# EAGLE design main (EAGLE 8.4.0)
CNAME: RJ Cunningham

## Sheet 1 of 10: Power Regulation A sheet for all the voltage regulators in use.
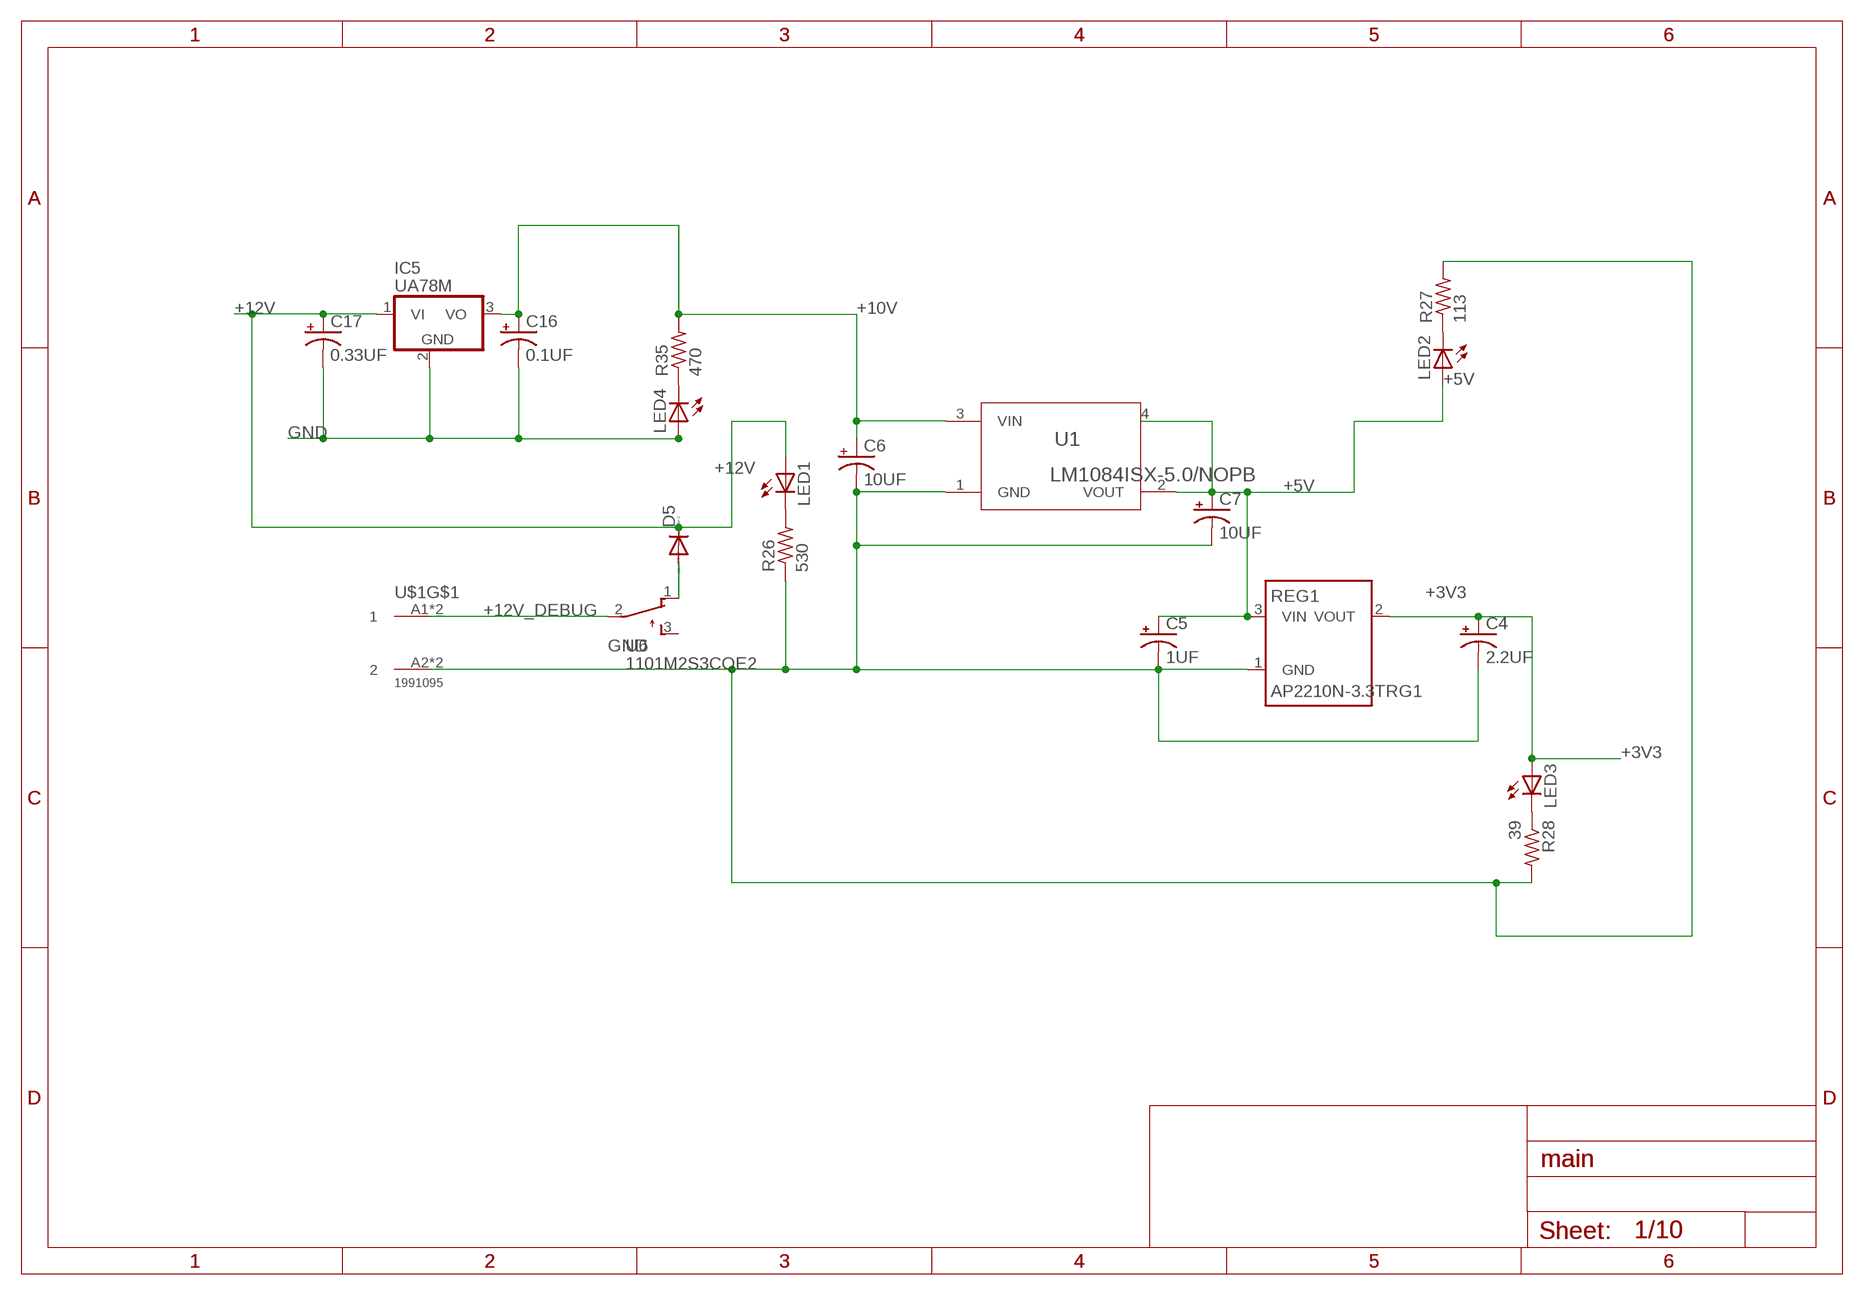
[diagram p0: schematic, sheet 1]

### Parts
C4  2.2UF  CPOL-USE2.5-5  [E2,5-5]
C5  1UF  CPOL-USE2.5-5  [E2,5-5]
C6  10UF  CPOL-USE2.5-5  [E2,5-5]
C7  10UF  CPOL-USE2.5-5  [E2,5-5]
C16  0.1UF  CPOL-USE2.5-5  [E2,5-5]
C17  0.33UF  CPOL-USE2.5-5  [E2,5-5]
D5  DIODE-DO201-15  [DO201-15]
IC5  UA78M  [TO220S]
LED1  LED5MM  [LED5MM]
LED2  LED5MM  [LED5MM]
LED3  LED5MM  [LED5MM]
LED4  LED5MM  [LED5MM]
R26  530  R-US_R0603  [R0603]
R27  113  R-US_R0603  [R0603]
R28  39  R-US_R0603  [R0603]
R35  470  R-US_R0603  [R0603]
REG1  AP2210N-3.3TRG1  [SOT23]
U1  LM1084ISX-5.0/NOPB  [TS3B]
U6  1101M2S3CQE2  [1101M2S3CQE2]
U$1  1991095  [1991095]

### Nets
+3V3: C4.+ LED3.A REG1.2(VOUT) ; also sheet 2,3,4
+5V: C5.+ C7.+ LED2.A REG1.3(VIN) U1.2(VOUT) U1.4 ; also sheet 8
+10V: C6.+ C16.+ IC5.3(VO) R35.2 U1.3(VIN) ; also sheet 3,8
+12V: C17.+ D5.C IC5.1(VI) LED1.A ; also sheet 5,6,8
+12V_DEBUG: U6.2(P) U$1.A1 U$1.B1
GND: C4.- C5.- C6.- C7.- C16.- C17.- IC5.2(GND) LED4.A R26.1 R27.2 R28.2 REG1.1(GND) U1.1(GND) U$1.A2 U$1.B2 ; also sheet 2,3,4,5,6,7,8
N$1: LED1.K(C) R26.2
N$2: LED2.K(C) R27.1
N$3: LED3.K(C) R28.1
N$4: D5.A U6.1(O)
N$9: LED4.K(C) R35.1
Unconnected: U6.3(S)

## Sheet 2 of 10: Load Cell Amplification A schematic for amplifying signals from the load cells. Additional Level-Shifting circuits may be necessary, this is important as well.
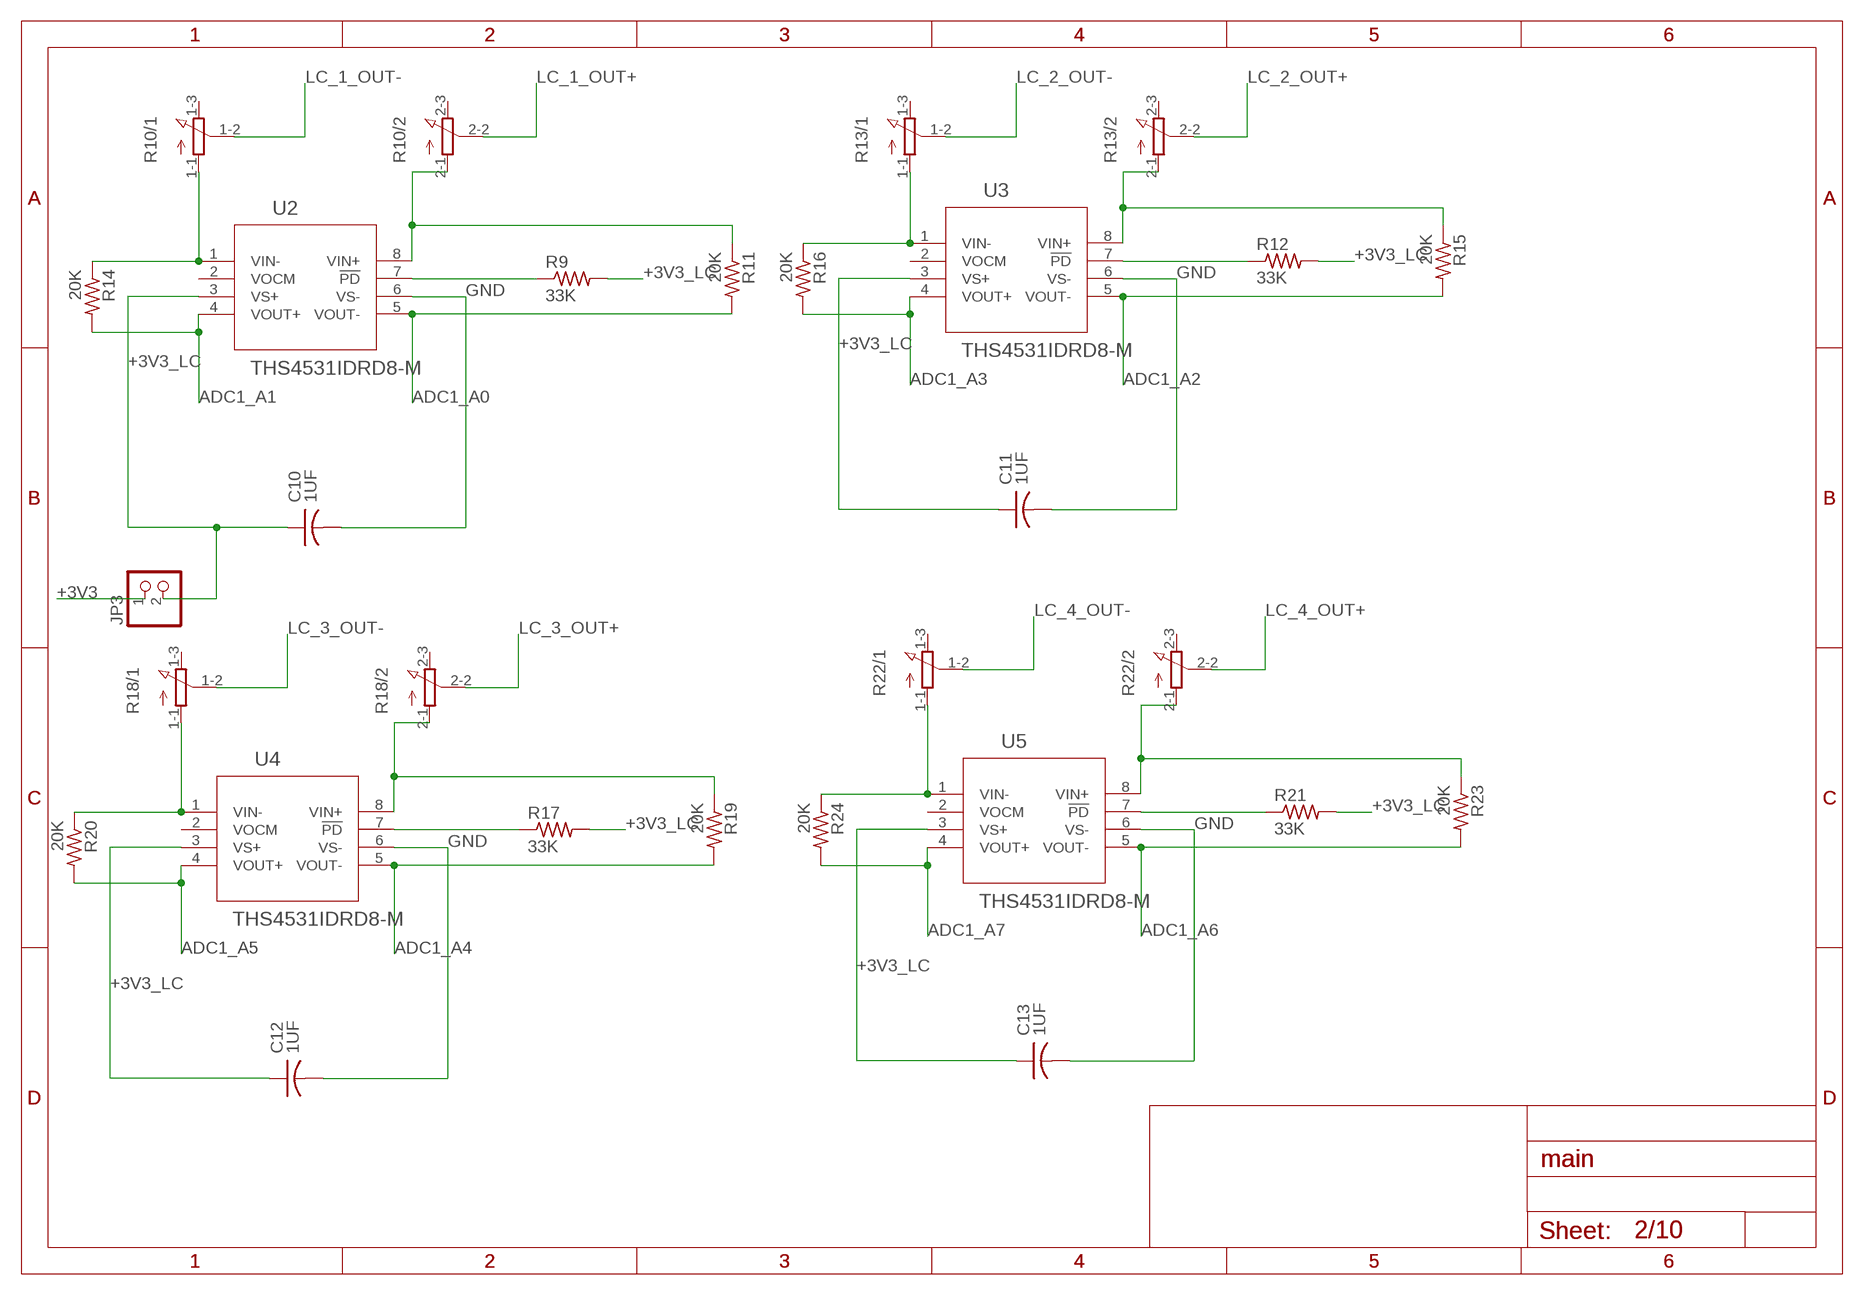
[diagram p1: schematic, sheet 2]

### Parts
C10  1UF  C-USC0603  [C0603]
C11  1UF  C-USC0603  [C0603]
C12  1UF  C-USC0603  [C0603]
C13  1UF  C-USC0603  [C0603]
JP3  PINHD-1X2  [1X02]
R9  33K  R-US_R0603  [R0603]
R10  PTD902  [PTD902]
R11  20K  R-US_R0603  [R0603]
R12  33K  R-US_R0603  [R0603]
R13  PTD902  [PTD902]
R14  20K  R-US_R0603  [R0603]
R15  20K  R-US_R0603  [R0603]
R16  20K  R-US_R0603  [R0603]
R17  33K  R-US_R0603  [R0603]
R18  PTD902  [PTD902]
R19  20K  R-US_R0603  [R0603]
R20  20K  R-US_R0603  [R0603]
R21  33K  R-US_R0603  [R0603]
R22  PTD902  [PTD902]
R23  20K  R-US_R0603  [R0603]
R24  20K  R-US_R0603  [R0603]
U2  THS4531IDRD8-M  [D8-M]
U3  THS4531IDRD8-M  [D8-M]
U4  THS4531IDRD8-M  [D8-M]
U5  THS4531IDRD8-M  [D8-M]

### Nets
+3V3: JP3.1 ; also sheet 1,3,4
+3V3_LC: C10.1 C11.1 C12.1 C13.1 JP3.2 R9.2 R12.2 R17.2 R21.2 U2.3(VS+) U3.3(VS+) U4.3(VS+) U5.3(VS+)
ADC1_A0: R11.2 U2.5(VOUT-) ; also sheet 4,9
ADC1_A1: R14.2 U2.4(VOUT+) ; also sheet 4,9
ADC1_A2: R15.2 U3.5(VOUT-) ; also sheet 4,9
ADC1_A3: R16.2 U3.4(VOUT+) ; also sheet 4,9
ADC1_A4: R19.2 U4.5(VOUT-) ; also sheet 4,9
ADC1_A5: R20.2 U4.4(VOUT+) ; also sheet 4,9
ADC1_A6: R23.2 U5.5(VOUT-) ; also sheet 4,9
ADC1_A7: R24.2 U5.4(VOUT+) ; also sheet 4,9
GND: C10.2 C11.2 C12.2 C13.2 U2.6(VS-) U3.6(VS-) U4.6(VS-) U5.6(VS-) ; also sheet 1,3,4,5,6,7,8
LC_1_OUT+: R10.2-2(/2:S) ; also sheet 8
LC_1_OUT-: R10.1-2(/1:S) ; also sheet 8
LC_2_OUT+: R13.2-2(/2:S) ; also sheet 8
LC_2_OUT-: R13.1-2(/1:S) ; also sheet 8
LC_3_OUT+: R18.2-2(/2:S) ; also sheet 8
LC_3_OUT-: R18.1-2(/1:S) ; also sheet 8
LC_4_OUT+: R22.2-2(/2:S) ; also sheet 8
LC_4_OUT-: R22.1-2(/1:S) ; also sheet 8
N$13: R9.1 U2.7(!PD)
N$14: R10.2-1(/2:A) R11.1 U2.8(VIN+)
N$15: R12.1 U3.7(!PD)
N$16: R13.2-1(/2:A) R15.1 U3.8(VIN+)
N$17: R10.1-1(/1:A) R14.1 U2.1(VIN-)
N$18: R13.1-1(/1:A) R16.1 U3.1(VIN-)
N$19: R17.1 U4.7(!PD)
N$20: R18.2-1(/2:A) R19.1 U4.8(VIN+)
N$21: R18.1-1(/1:A) R20.1 U4.1(VIN-)
N$22: R21.1 U5.7(!PD)
N$23: R22.2-1(/2:A) R23.1 U5.8(VIN+)
N$24: R22.1-1(/1:A) R24.1 U5.1(VIN-)
Unconnected: R10.1-3(/1:E) R10.2-3(/2:E) R13.1-3(/1:E) R13.2-3(/2:E) R18.1-3(/1:E) R18.2-3(/2:E) R22.1-3(/1:E) R22.2-3(/2:E) U2.2(VOCM) U3.2(VOCM) U4.2(VOCM) U5.2(VOCM)

## Sheet 3 of 10: PT Amplification Circuits for measuring PT
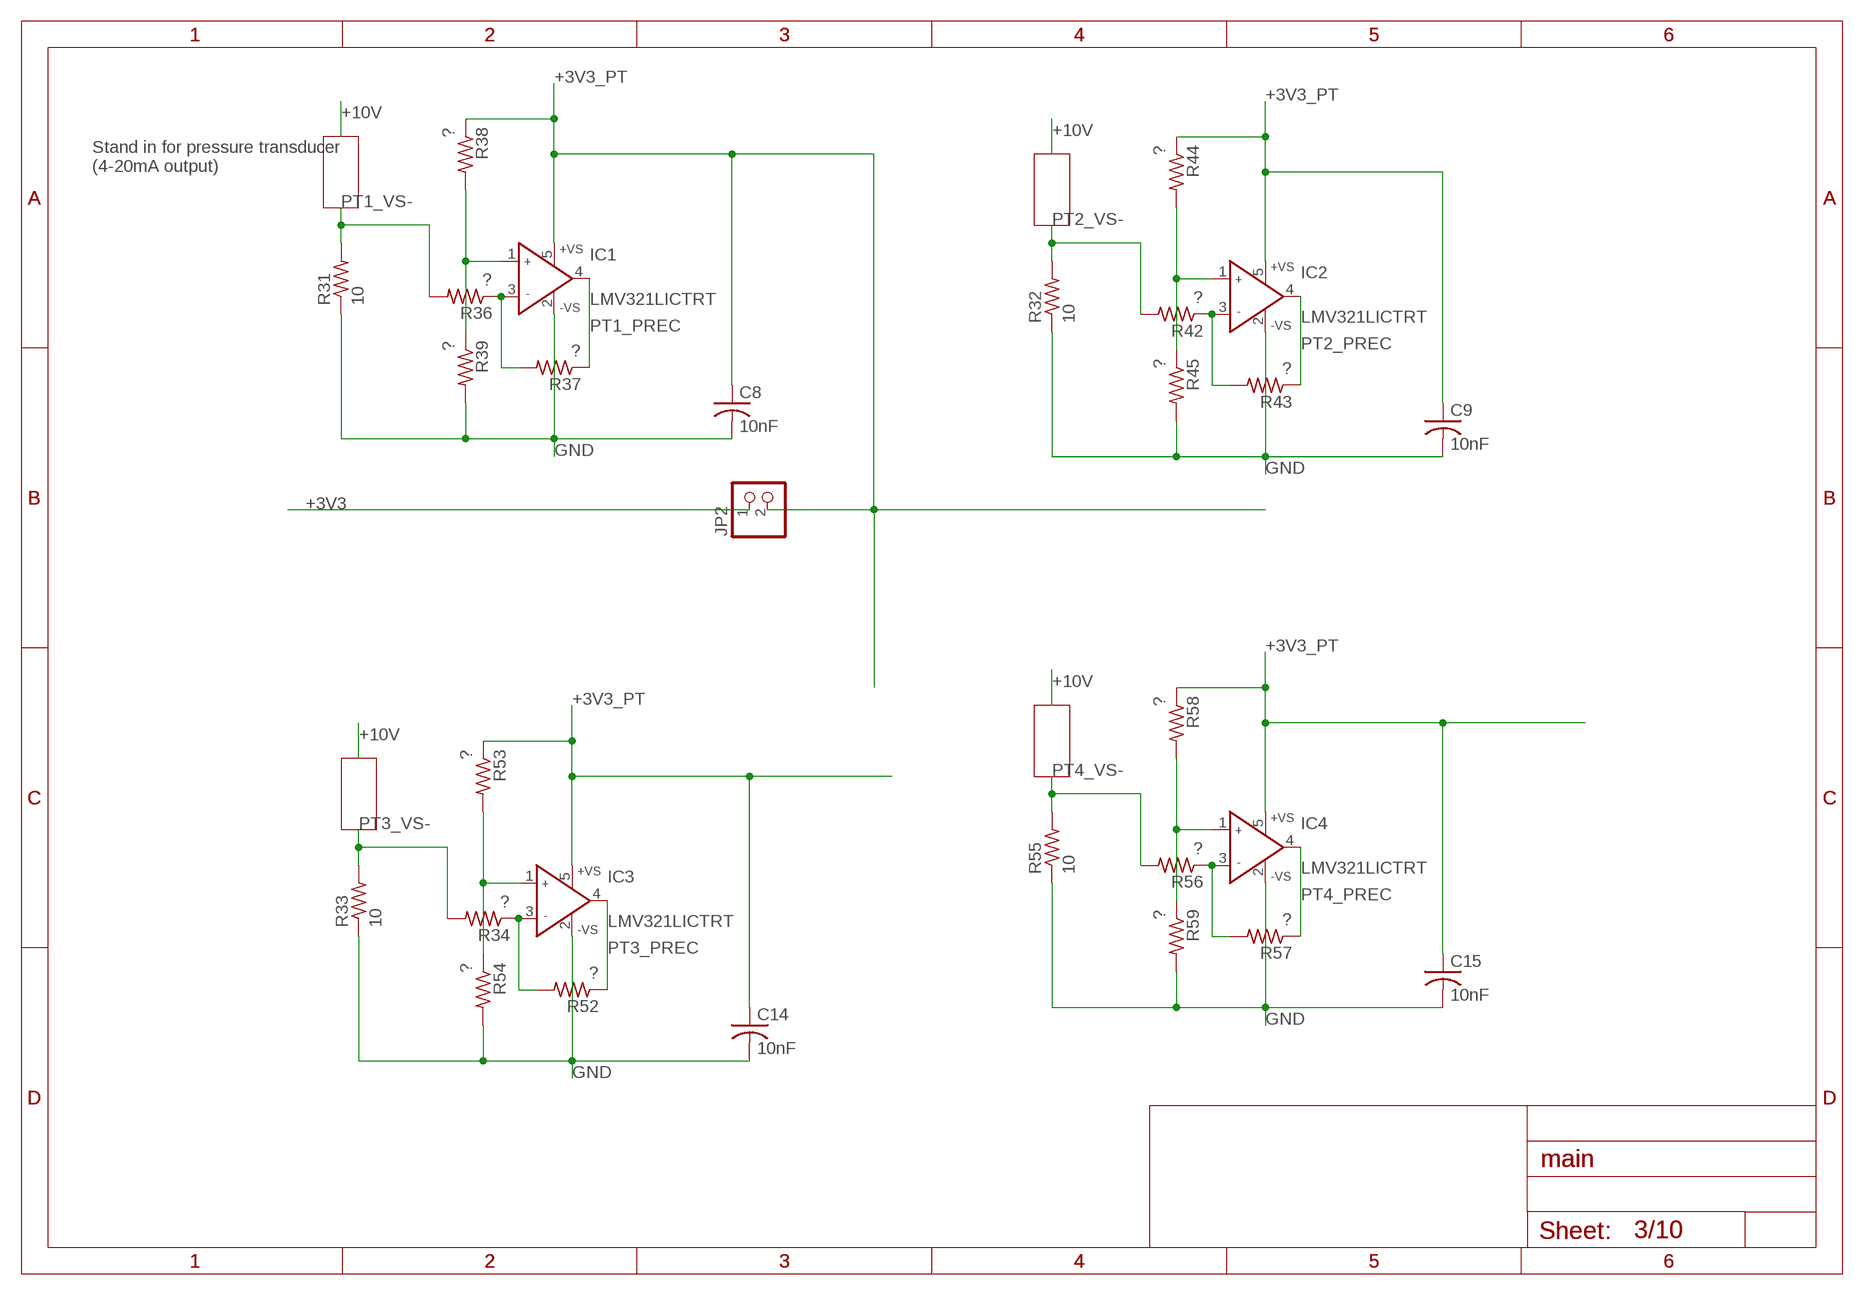
[diagram p2: schematic, sheet 3]

### Parts
C8  10nF  C-USC0402K  [C0402K]
C9  10nF  C-USC0402K  [C0402K]
C14  10nF  C-USC0402K  [C0402K]
C15  10nF  C-USC0402K  [C0402K]
IC1  LMV321LICTRT  [SOT23-5]
IC2  LMV321LICTRT  [SOT23-5]
IC3  LMV321LICTRT  [SOT23-5]
IC4  LMV321LICTRT  [SOT23-5]
JP2  PINHD-1X2  [1X02]
R31  10  R-US_R0603  [R0603]
R32  10  R-US_R0603  [R0603]
R33  10  R-US_R0603  [R0603]
R34  ?  R-US_0204/7  [0204/7]
R36  ?  R-US_0204/7  [0204/7]
R37  ?  R-US_0204/7  [0204/7]
R38  ?  R-US_0204/7  [0204/7]
R39  ?  R-US_0204/7  [0204/7]
R42  ?  R-US_0204/7  [0204/7]
R43  ?  R-US_0204/7  [0204/7]
R44  ?  R-US_0204/7  [0204/7]
R45  ?  R-US_0204/7  [0204/7]
R52  ?  R-US_0204/7  [0204/7]
R53  ?  R-US_0204/7  [0204/7]
R54  ?  R-US_0204/7  [0204/7]
R55  10  R-US_R0603  [R0603]
R56  ?  R-US_0204/7  [0204/7]
R57  ?  R-US_0204/7  [0204/7]
R58  ?  R-US_0204/7  [0204/7]
R59  ?  R-US_0204/7  [0204/7]

### Nets
+3V3: JP2.1 ; also sheet 1,2,4
+3V3_PT: C8.1 C9.1 C14.1 C15.1 IC1.5(+VS) IC2.5(+VS) IC3.5(+VS) IC4.5(+VS) JP2.2 R38.1 R44.1 R53.1 R58.1 ; also sheet 7
GND: C8.2 C9.2 C14.2 C15.2 IC1.2(-VS) IC2.2(-VS) IC3.2(-VS) IC4.2(-VS) R31.1 R32.1 R33.1 R39.2 R45.2 R54.2 R55.1 R59.2 ; also sheet 1,2,4,5,6,7,8
N$10: IC1.3(IN-) R36.1 R37.2
N$12: IC1.1(IN+) R38.2 R39.1
N$26: IC2.3(IN-) R42.1 R43.2
N$27: IC2.1(IN+) R44.2 R45.1
N$34: IC3.3(IN-) R34.1 R52.2
N$35: IC3.1(IN+) R53.2 R54.1
N$36: IC4.3(IN-) R56.1 R57.2
N$37: IC4.1(IN+) R58.2 R59.1
PT1_PREC: IC1.4(OUT) R37.1 ; also sheet 7
PT1_VS-: R31.2 R36.2 ; also sheet 8
PT2_PREC: IC2.4(OUT) R43.1 ; also sheet 7
PT2_VS-: R32.2 R42.2 ; also sheet 8
PT3_PREC: IC3.4(OUT) R52.1 ; also sheet 7
PT3_VS-: R33.2 R34.2 ; also sheet 8
PT4_PREC: IC4.4(OUT) R57.1 ; also sheet 7
PT4_VS-: R55.2 R56.2 ; also sheet 8

### Notes on the sheet
- Stand in for pressure transducer
  (4-20mA output)

## Sheet 4 of 10: ADC The updated schematic for the adc because the old one is on backorder.
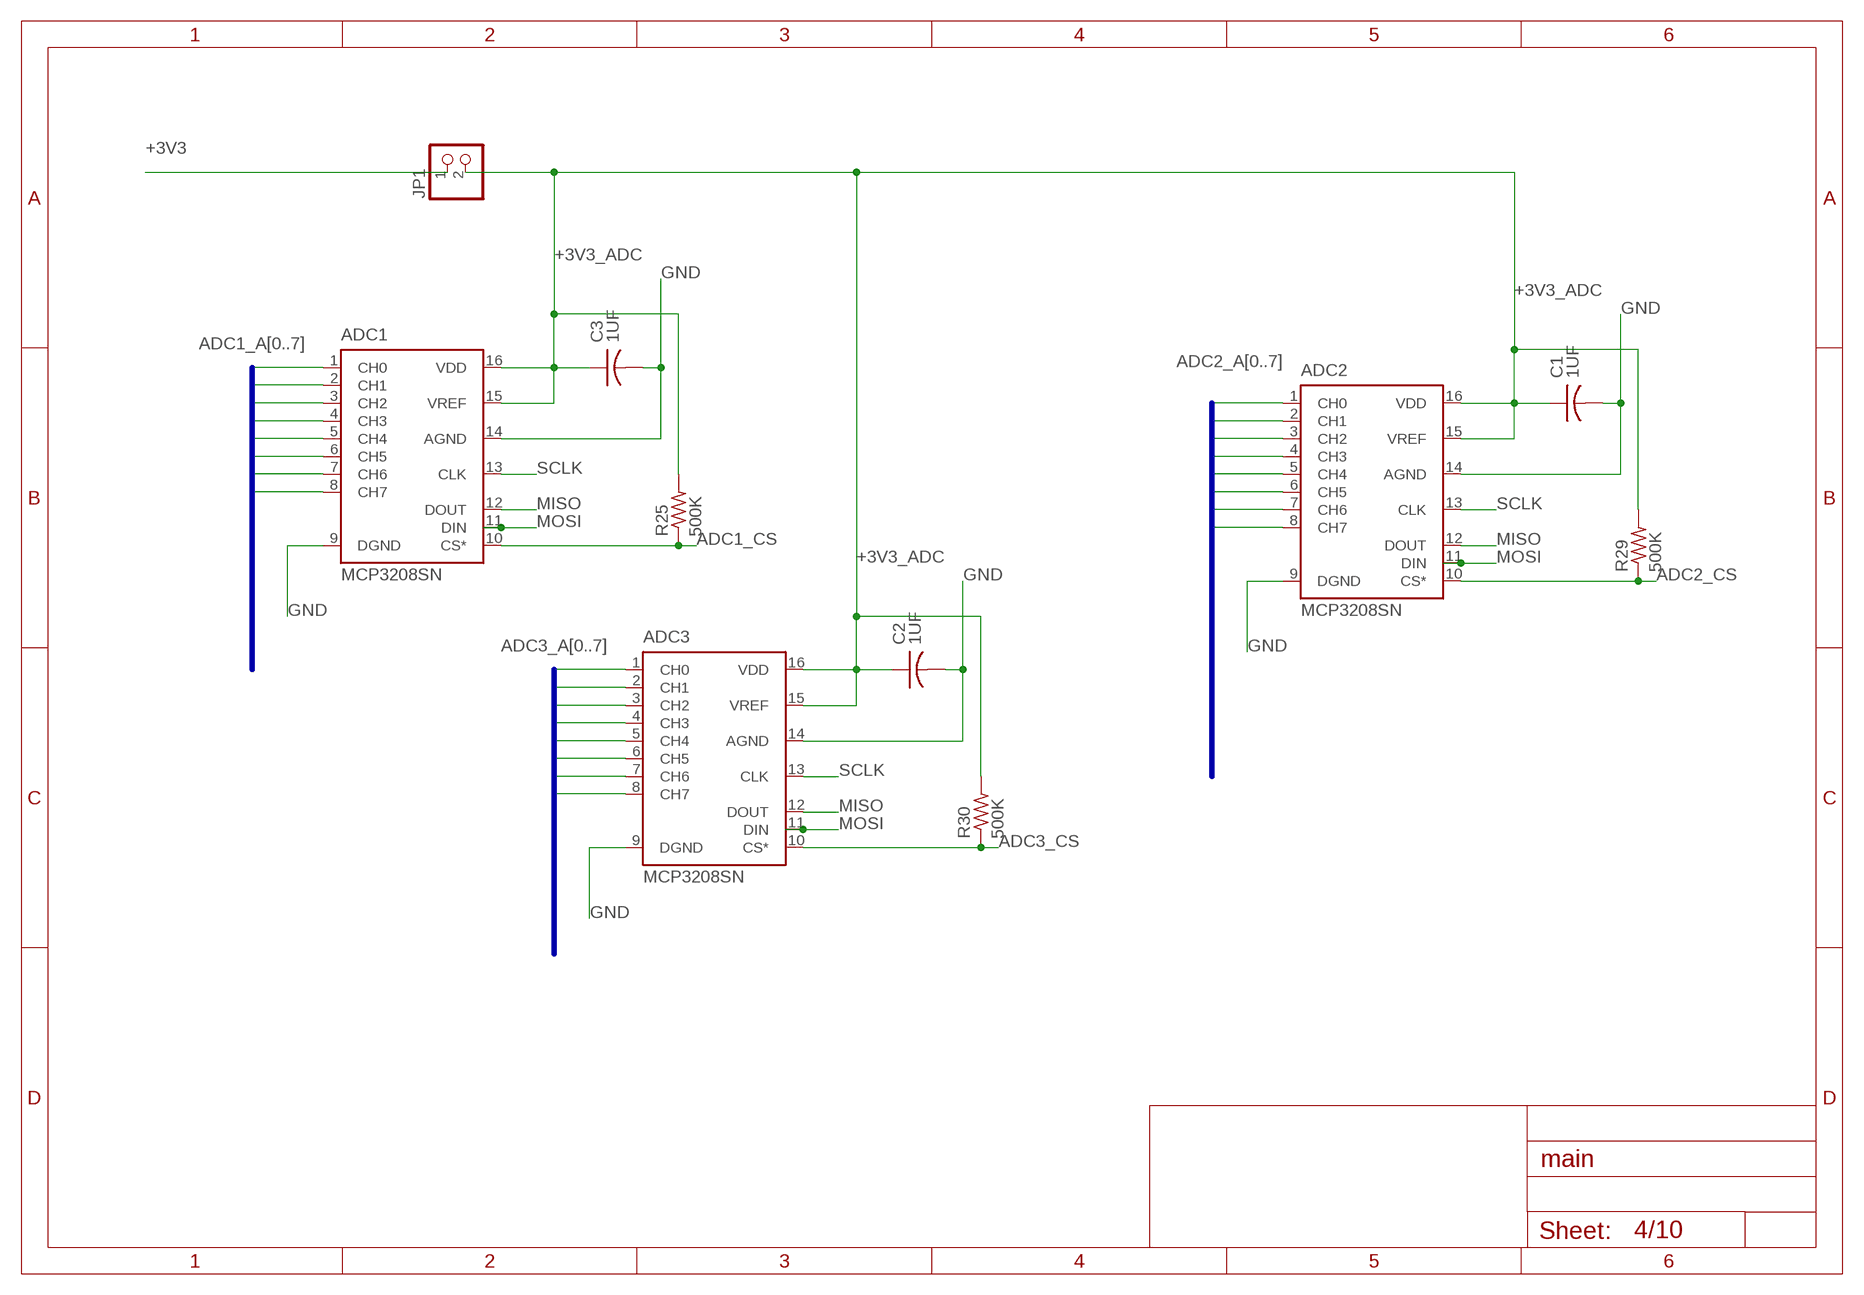
[diagram p3: schematic, sheet 4]

### Parts
ADC1  MCP3208SN  [SO-16]
ADC2  MCP3208SN  [SO-16]
ADC3  MCP3208SN  [SO-16]
C1  1UF  C-USC0603  [C0603]
C2  1UF  C-USC0603  [C0603]
C3  1UF  C-USC0603  [C0603]
JP1  PINHD-1X2  [1X02]
R25  500K  R-US_R0603  [R0603]
R29  500K  R-US_R0603  [R0603]
R30  500K  R-US_R0603  [R0603]

### Nets
+3V3: JP1.1 ; also sheet 1,2,3
+3V3_ADC: ADC1.15(VREF) ADC1.16(VDD) ADC2.15(VREF) ADC2.16(VDD) ADC3.15(VREF) ADC3.16(VDD) C1.1 C2.1 C3.1 JP1.2 R25.2 R29.2 R30.2
ADC1_A0: ADC1.1(CH0) ; also sheet 2,9
ADC1_A1: ADC1.2(CH1) ; also sheet 2,9
ADC1_A2: ADC1.3(CH2) ; also sheet 2,9
ADC1_A3: ADC1.4(CH3) ; also sheet 2,9
ADC1_A4: ADC1.5(CH4) ; also sheet 2,9
ADC1_A5: ADC1.6(CH5) ; also sheet 2,9
ADC1_A6: ADC1.7(CH6) ; also sheet 2,9
ADC1_A7: ADC1.8(CH7) ; also sheet 2,9
ADC1_CS: ADC1.10(CS*) R25.1 ; also sheet 8
ADC2_A0: ADC2.1(CH0) ; also sheet 7,9
ADC2_A1: ADC2.2(CH1) ; also sheet 7,9
ADC2_A2: ADC2.3(CH2) ; also sheet 7,9
ADC2_A3: ADC2.4(CH3) ; also sheet 7,9
ADC2_A4: ADC2.5(CH4) ; also sheet 8,9
ADC2_A5: ADC2.6(CH5) ; also sheet 8,9
ADC2_A6: ADC2.7(CH6) ; also sheet 8,9
ADC2_A7: ADC2.8(CH7) ; also sheet 8,9
ADC2_CS: ADC2.10(CS*) R29.1 ; also sheet 8
ADC3_A0: ADC3.1(CH0) ; also sheet 9
ADC3_A1: ADC3.2(CH1) ; also sheet 9
ADC3_A2: ADC3.3(CH2) ; also sheet 9
ADC3_A3: ADC3.4(CH3) ; also sheet 9
ADC3_A4: ADC3.5(CH4) ; also sheet 9
ADC3_A5: ADC3.6(CH5) ; also sheet 9
ADC3_A6: ADC3.7(CH6) ; also sheet 9
ADC3_A7: ADC3.8(CH7) ; also sheet 9
ADC3_CS: ADC3.10(CS*) R30.1 ; also sheet 8
GND: ADC1.9(DGND) ADC1.14(AGND) ADC2.9(DGND) ADC2.14(AGND) ADC3.9(DGND) ADC3.14(AGND) C1.2 C2.2 C3.2 ; also sheet 1,2,3,5,6,7,8
MISO: ADC1.12(DOUT) ADC2.12(DOUT) ADC3.12(DOUT) ; also sheet 8
MOSI: ADC1.11(DIN) ADC2.11(DIN) ADC3.11(DIN) ; also sheet 8
SCLK: ADC1.13(CLK) ADC2.13(CLK) ADC3.13(CLK) ; also sheet 8

### Buses
ADC1_A[0..7]
ADC2_A[0..7]
ADC3_A[0..7]

## Sheet 5 of 10: Solenoid Driver A circuit that controls the driver for the solenoid.
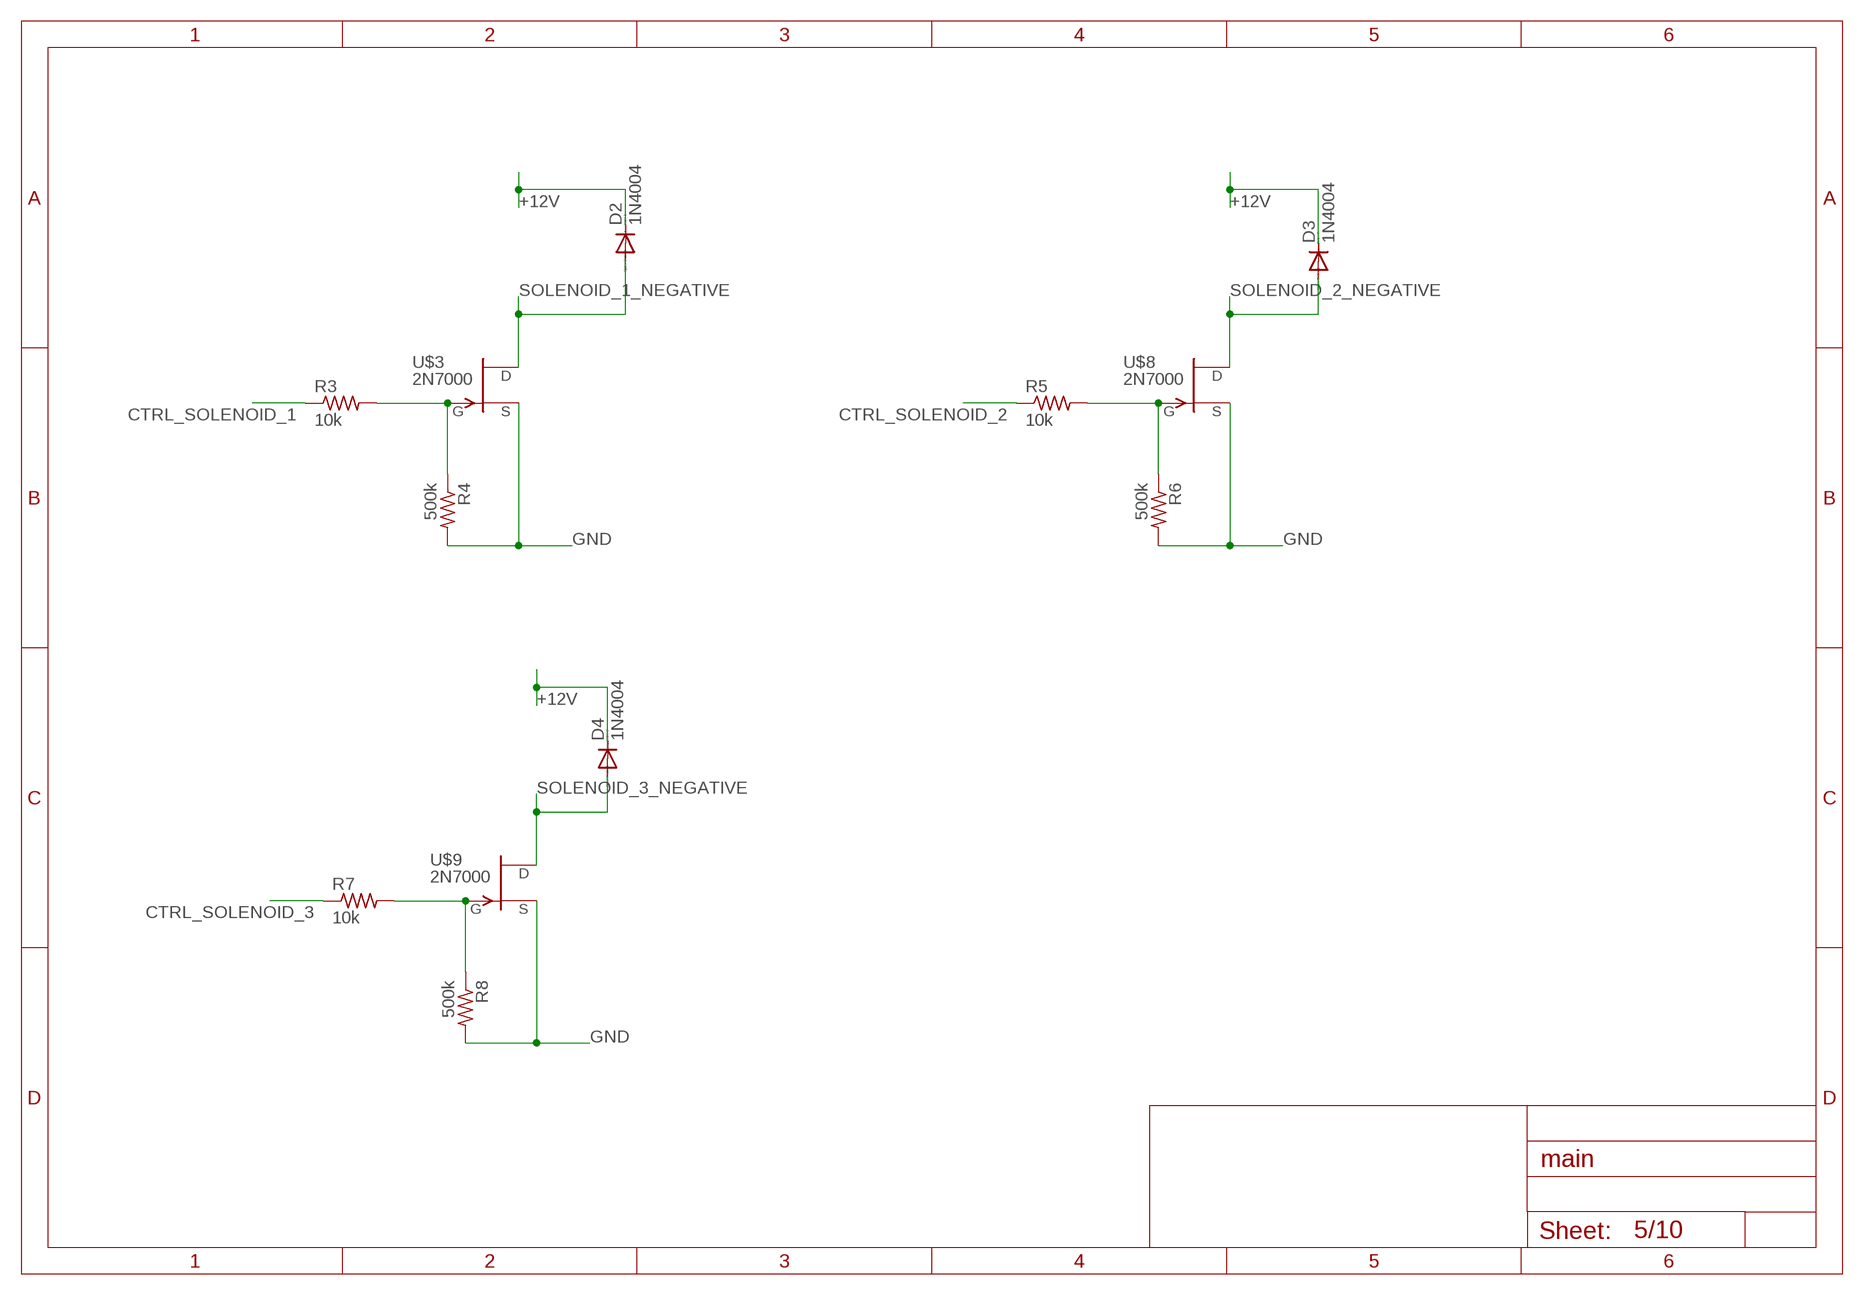
[diagram p4: schematic, sheet 5]

### Parts
D2  1N4004  [DO41-10]
D3  1N4004  [DO41-10]
D4  1N4004  [DO41-10]
R3  10k  R-US_R0603  [R0603]
R4  500k  R-US_R0603  [R0603]
R5  10k  R-US_R0603  [R0603]
R6  500k  R-US_R0603  [R0603]
R7  10k  R-US_R0603  [R0603]
R8  500k  R-US_R0603  [R0603]
U$3  2N7000  [SOT23]
U$8  2N7000  [SOT23]
U$9  2N7000  [SOT23]

### Nets
+12V: D2.C D3.C D4.C ; also sheet 1,6,8
CTRL_SOLENOID_1: R3.1 ; also sheet 8
CTRL_SOLENOID_2: R5.1 ; also sheet 8
CTRL_SOLENOID_3: R7.1 ; also sheet 8
GND: R4.2 R6.2 R8.2 U$3.2(S) U$8.2(S) U$9.2(S) ; also sheet 1,2,3,4,6,7,8
N$6: R3.2 R4.1 U$3.1(G)
N$7: R5.2 R6.1 U$8.1(G)
N$8: R7.2 R8.1 U$9.1(G)
SOLENOID_1_NEGATIVE: D2.A U$3.3(D) ; also sheet 8
SOLENOID_2_NEGATIVE: D3.A U$8.3(D) ; also sheet 8
SOLENOID_3_NEGATIVE: D4.A U$9.3(D) ; also sheet 8

## Sheet 6 of 10: Ignition Driver A circuit that controls the relay for the igniter.
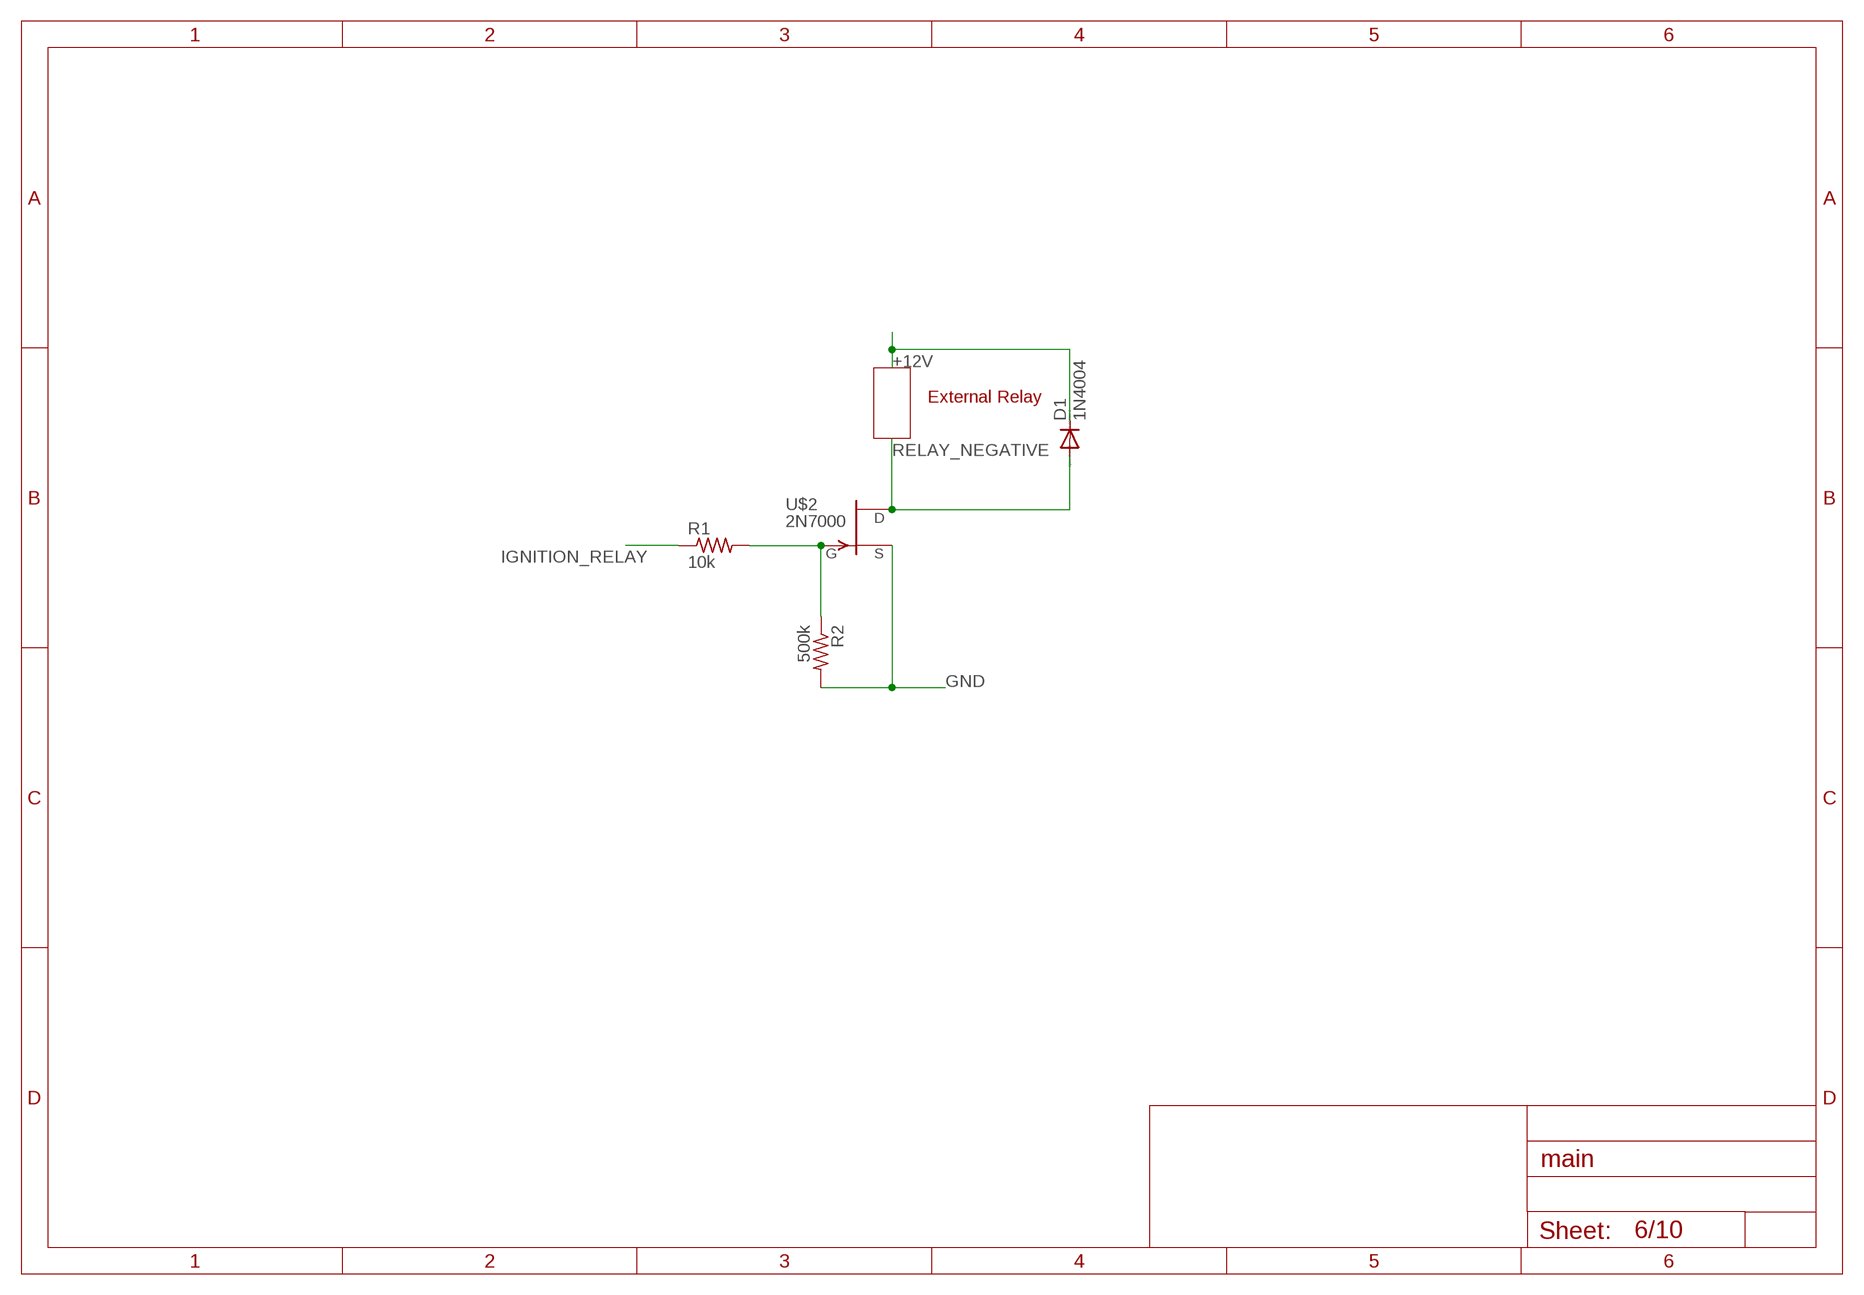
[diagram p5: schematic, sheet 6]

### Parts
D1  1N4004  [DO41-10]
R1  10k  R-US_R0603  [R0603]
R2  500k  R-US_R0603  [R0603]
U$2  2N7000  [SOT23]

### Nets
+12V: D1.C ; also sheet 1,5,8
GND: R2.2 U$2.2(S) ; also sheet 1,2,3,4,5,7,8
IGNITION_RELAY: R1.1 ; also sheet 8
N$5: R1.2 R2.1 U$2.1(G)
RELAY_NEGATIVE: D1.A U$2.3(D) ; also sheet 8

### Notes on the sheet
- External Relay

## Sheet 7 of 10: Anti-Aliasing Circuits used for anti-aliasing all sampled signals. May need to be split across multiple sheets. If so, feel free to do so.
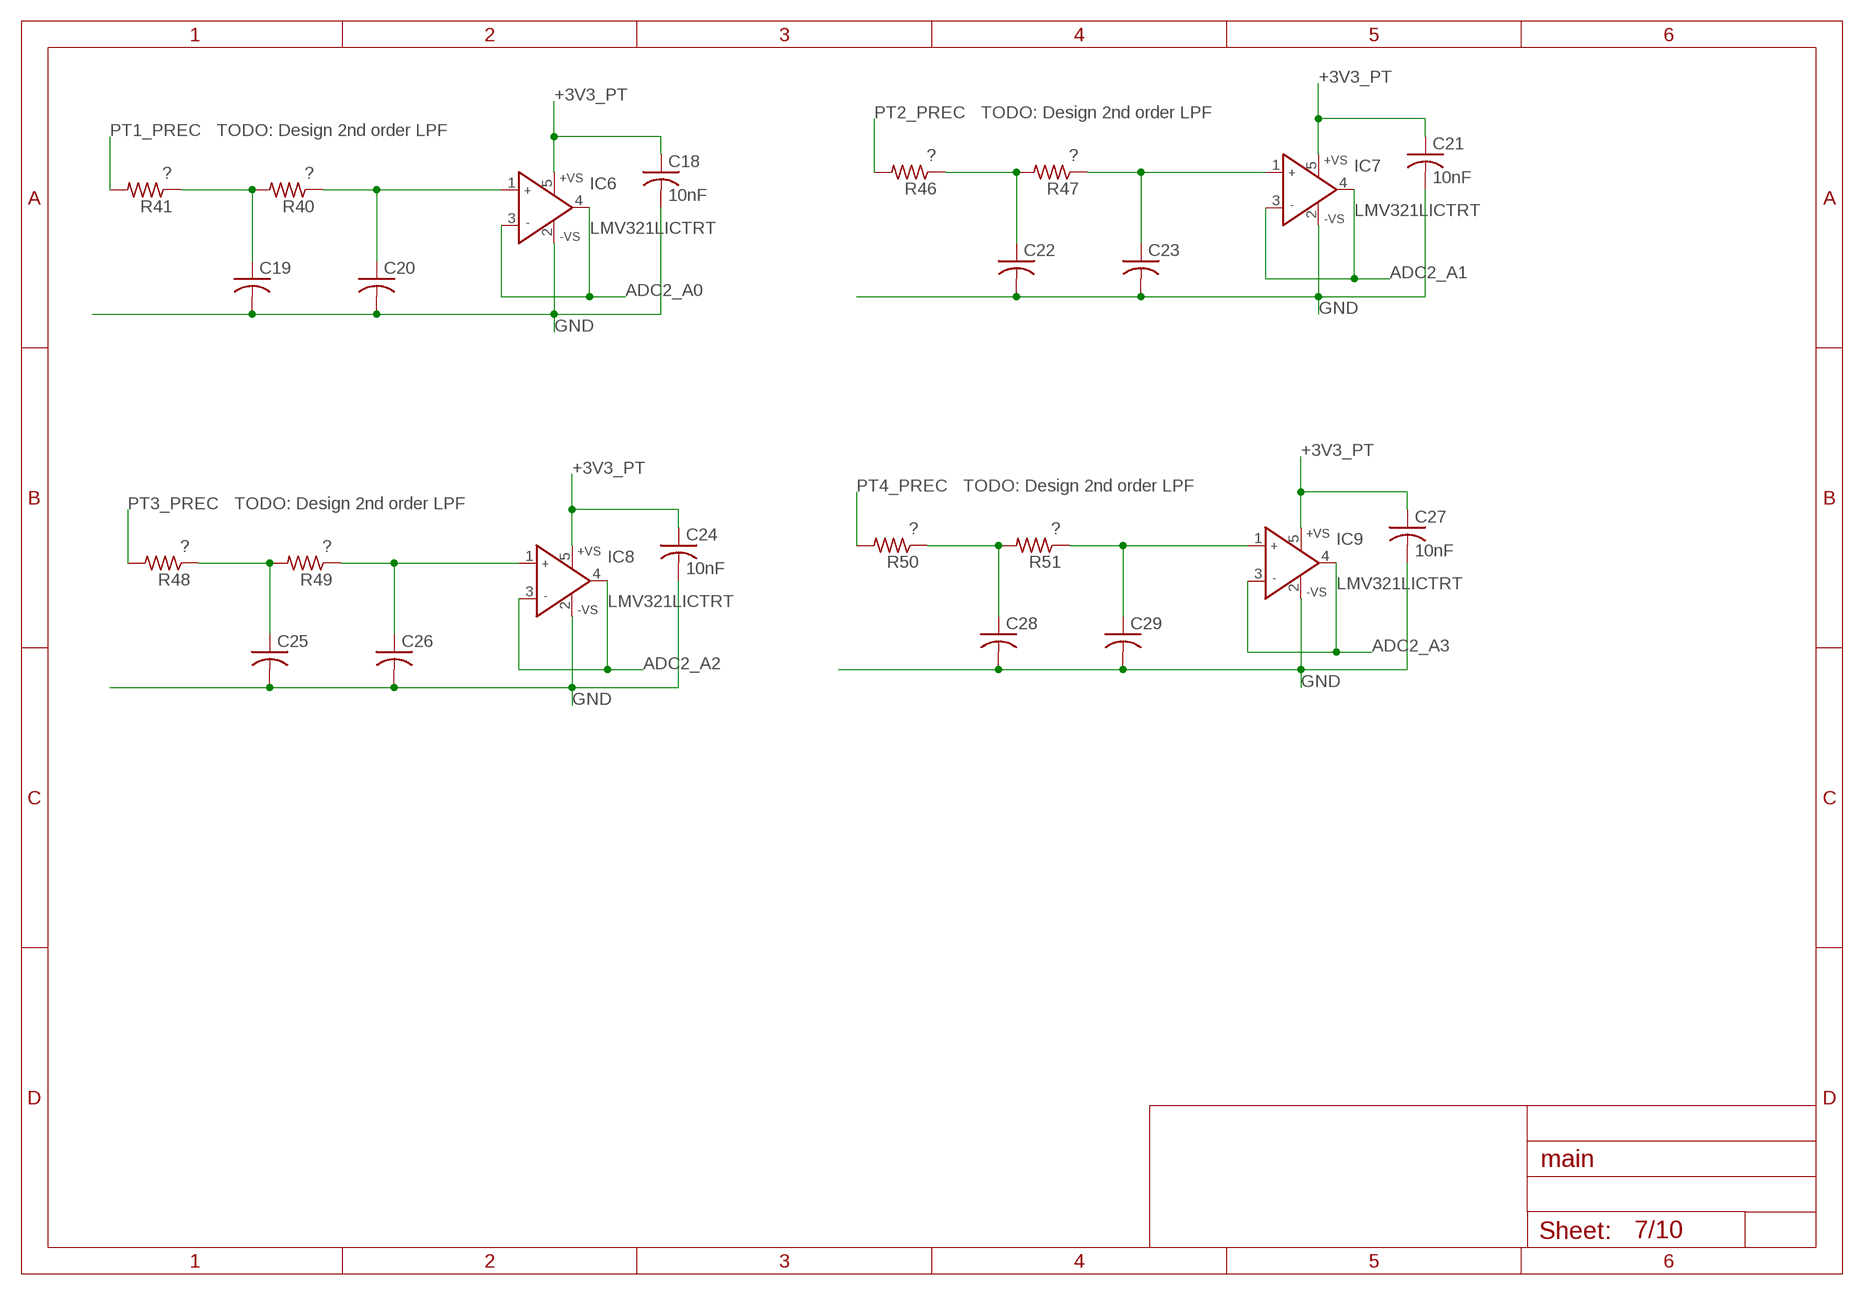
[diagram p6: schematic, sheet 7]

### Parts
C18  10nF  C-USC0402K  [C0402K]
C19  C-US025-025X050  [C025-025X050]
C20  C-US025-025X050  [C025-025X050]
C21  10nF  C-USC0402K  [C0402K]
C22  C-US025-025X050  [C025-025X050]
C23  C-US025-025X050  [C025-025X050]
C24  10nF  C-USC0402K  [C0402K]
C25  C-US025-025X050  [C025-025X050]
C26  C-US025-025X050  [C025-025X050]
C27  10nF  C-USC0402K  [C0402K]
C28  C-US025-025X050  [C025-025X050]
C29  C-US025-025X050  [C025-025X050]
IC6  LMV321LICTRT  [SOT23-5]
IC7  LMV321LICTRT  [SOT23-5]
IC8  LMV321LICTRT  [SOT23-5]
IC9  LMV321LICTRT  [SOT23-5]
R40  ?  R-US_0204/7  [0204/7]
R41  ?  R-US_0204/7  [0204/7]
R46  ?  R-US_0204/7  [0204/7]
R47  ?  R-US_0204/7  [0204/7]
R48  ?  R-US_0204/7  [0204/7]
R49  ?  R-US_0204/7  [0204/7]
R50  ?  R-US_0204/7  [0204/7]
R51  ?  R-US_0204/7  [0204/7]

### Nets
+3V3_PT: C18.1 C21.1 C24.1 C27.1 IC6.5(+VS) IC7.5(+VS) IC8.5(+VS) IC9.5(+VS) ; also sheet 3
ADC2_A0: IC6.3(IN-) IC6.4(OUT) ; also sheet 4,9
ADC2_A1: IC7.3(IN-) IC7.4(OUT) ; also sheet 4,9
ADC2_A2: IC8.3(IN-) IC8.4(OUT) ; also sheet 4,9
ADC2_A3: IC9.3(IN-) IC9.4(OUT) ; also sheet 4,9
GND: C18.2 C19.2 C20.2 C21.2 C22.2 C23.2 C24.2 C25.2 C26.2 C27.2 C28.2 C29.2 IC6.2(-VS) IC7.2(-VS) IC8.2(-VS) IC9.2(-VS) ; also sheet 1,2,3,4,5,6,8
N$11: C19.1 R40.2 R41.1
N$25: C20.1 IC6.1(IN+) R40.1
N$28: C22.1 R46.1 R47.2
N$29: C23.1 IC7.1(IN+) R47.1
N$30: C25.1 R48.1 R49.2
N$31: C26.1 IC8.1(IN+) R49.1
N$32: C28.1 R50.1 R51.2
N$33: C29.1 IC9.1(IN+) R51.1
PT1_PREC: R41.2 ; also sheet 3
PT2_PREC: R46.2 ; also sheet 3
PT3_PREC: R48.2 ; also sheet 3
PT4_PREC: R50.2 ; also sheet 3

### Notes on the sheet
- TODO: Design 2nd order LPF
- TODO: Design 2nd order LPF
- TODO: Design 2nd order LPF
- TODO: Design 2nd order LPF

## Sheet 8 of 10: External Connectors All the external connectors used on the board.
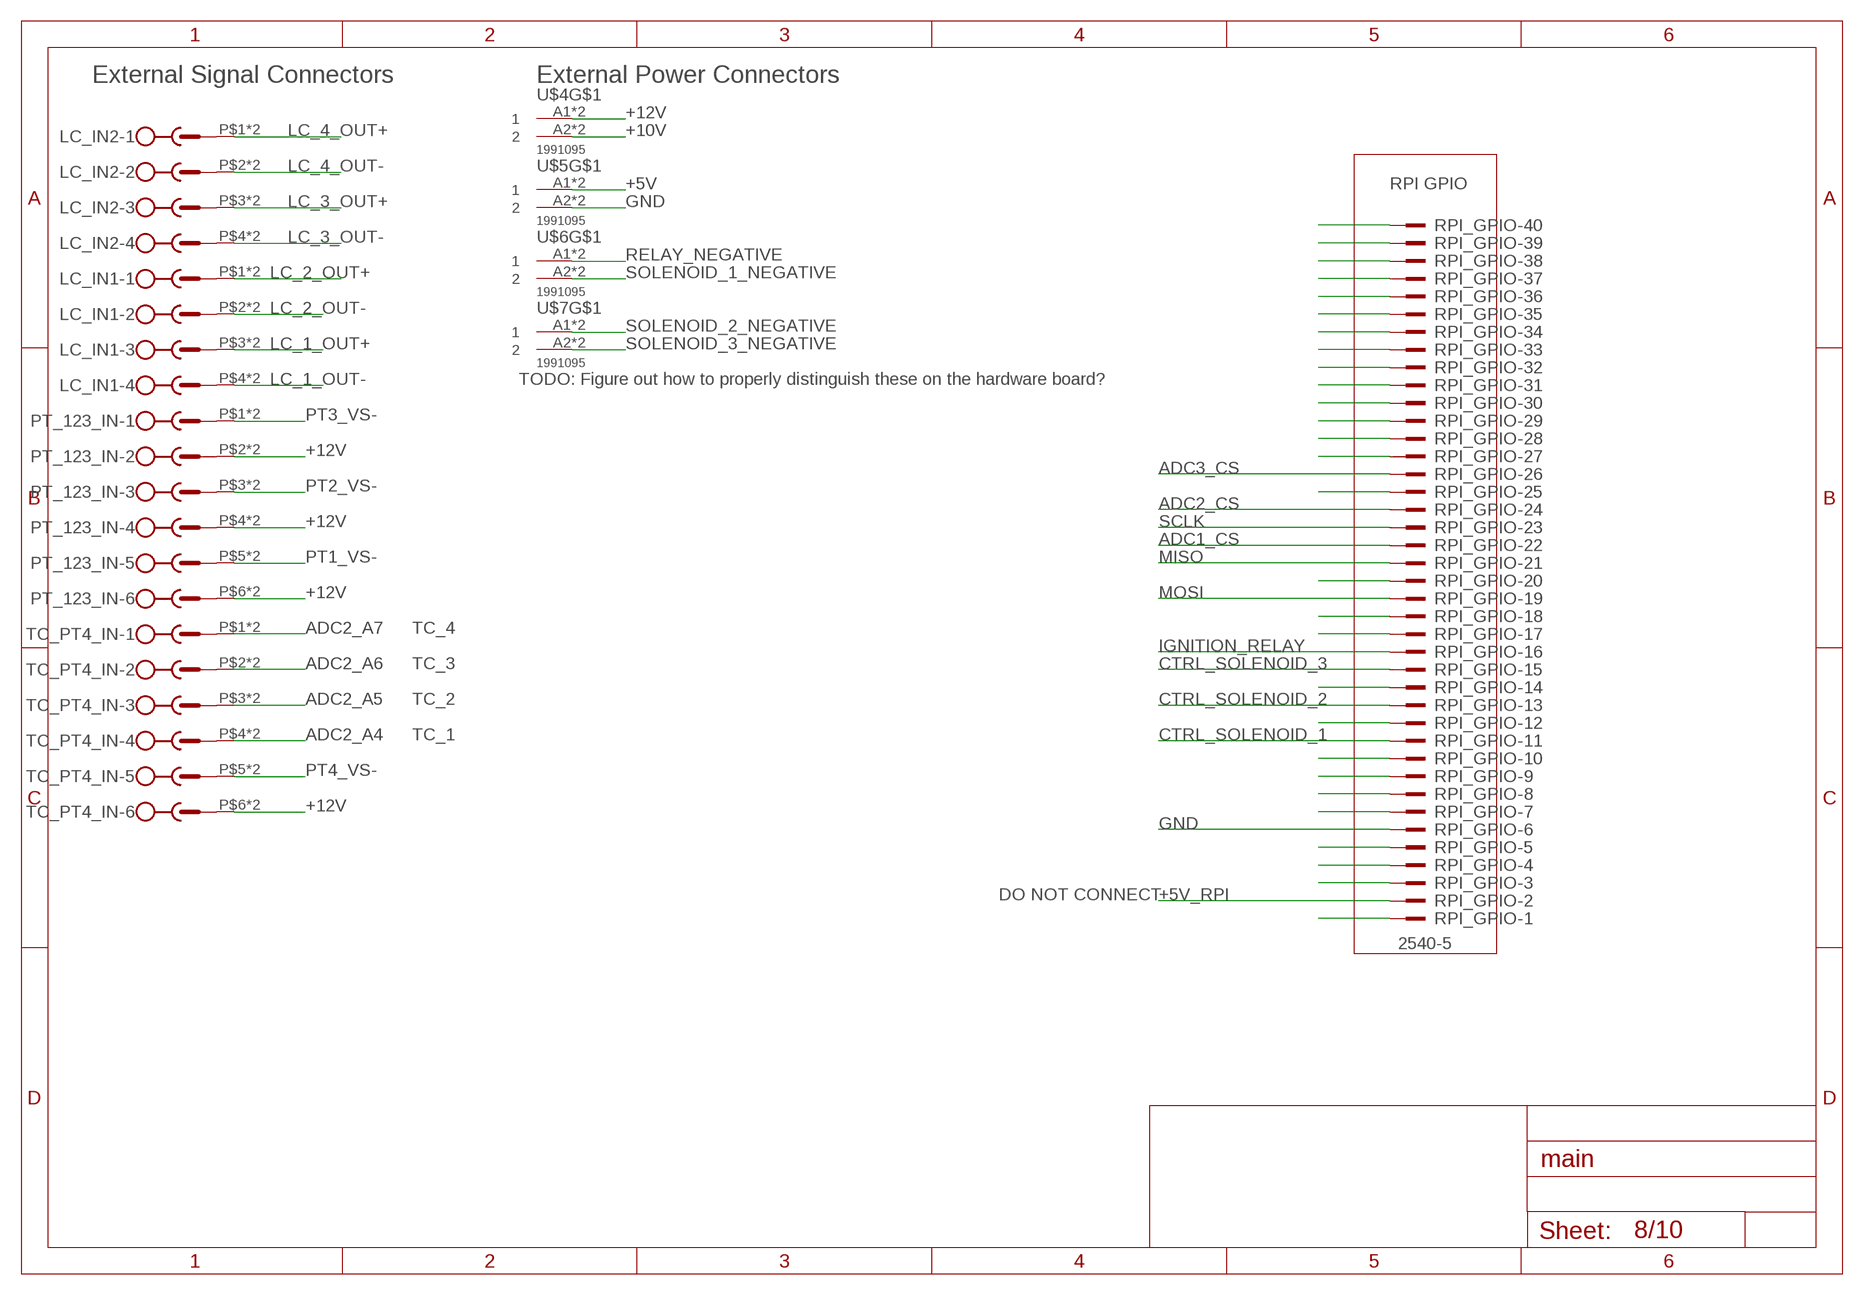
[diagram p7: schematic, sheet 8]

### Parts
LC_IN1  1770908  [1770908]
LC_IN2  1770908  [1770908]
PT_123_IN  1770924  [1770924]
RPI_GPIO  2540-5  [PAK100/2500-5-40]
TC_PT4_IN  1770924  [1770924]
U$4  1991095  [1991095]
U$5  1991095  [1991095]
U$6  1991095  [1991095]
U$7  1991095  [1991095]

### Nets
+5V: U$5.A1 U$5.B1 ; also sheet 1
+5V_RPI: RPI_GPIO.2
+10V: U$4.A2 U$4.B2 ; also sheet 1,3
+12V: PT_123_IN.P$2 PT_123_IN.P$4 PT_123_IN.P$6 PT_123_IN.P$8 PT_123_IN.P$10 PT_123_IN.P$12 TC_PT4_IN.P$6 TC_PT4_IN.P$12 U$4.A1 U$4.B1 ; also sheet 1,5,6
ADC1_CS: RPI_GPIO.22 ; also sheet 4
ADC2_A4: TC_PT4_IN.P$4 TC_PT4_IN.P$10 ; also sheet 4,9
ADC2_A5: TC_PT4_IN.P$3 TC_PT4_IN.P$9 ; also sheet 4,9
ADC2_A6: TC_PT4_IN.P$2 TC_PT4_IN.P$8 ; also sheet 4,9
ADC2_A7: TC_PT4_IN.P$1 TC_PT4_IN.P$7 ; also sheet 4,9
ADC2_CS: RPI_GPIO.24 ; also sheet 4
ADC3_CS: RPI_GPIO.26 ; also sheet 4
CTRL_SOLENOID_1: RPI_GPIO.11 ; also sheet 5
CTRL_SOLENOID_2: RPI_GPIO.13 ; also sheet 5
CTRL_SOLENOID_3: RPI_GPIO.15 ; also sheet 5
GND: RPI_GPIO.6 U$5.A2 U$5.B2 ; also sheet 1,2,3,4,5,6,7
IGNITION_RELAY: RPI_GPIO.16 ; also sheet 6
LC_1_OUT+: LC_IN1.P$3 LC_IN1.P$7 ; also sheet 2
LC_1_OUT-: LC_IN1.P$4 LC_IN1.P$8 ; also sheet 2
LC_2_OUT+: LC_IN1.P$1 LC_IN1.P$5 ; also sheet 2
LC_2_OUT-: LC_IN1.P$2 LC_IN1.P$6 ; also sheet 2
LC_3_OUT+: LC_IN2.P$3 LC_IN2.P$7 ; also sheet 2
LC_3_OUT-: LC_IN2.P$4 LC_IN2.P$8 ; also sheet 2
LC_4_OUT+: LC_IN2.P$1 LC_IN2.P$5 ; also sheet 2
LC_4_OUT-: LC_IN2.P$2 LC_IN2.P$6 ; also sheet 2
MISO: RPI_GPIO.21 ; also sheet 4
MOSI: RPI_GPIO.19 ; also sheet 4
PT1_VS-: PT_123_IN.P$5 PT_123_IN.P$11 ; also sheet 3
PT2_VS-: PT_123_IN.P$3 PT_123_IN.P$9 ; also sheet 3
PT3_VS-: PT_123_IN.P$1 PT_123_IN.P$7 ; also sheet 3
PT4_VS-: TC_PT4_IN.P$5 TC_PT4_IN.P$11 ; also sheet 3
RELAY_NEGATIVE: U$6.A1 U$6.B1 ; also sheet 6
RPI_GPIO_1: RPI_GPIO.1
RPI_GPIO_3: RPI_GPIO.3
RPI_GPIO_4: RPI_GPIO.4
RPI_GPIO_5: RPI_GPIO.5
RPI_GPIO_7: RPI_GPIO.7
RPI_GPIO_8: RPI_GPIO.8
RPI_GPIO_9: RPI_GPIO.9
RPI_GPIO_10: RPI_GPIO.10
RPI_GPIO_12: RPI_GPIO.12
RPI_GPIO_14: RPI_GPIO.14
RPI_GPIO_17: RPI_GPIO.17
RPI_GPIO_18: RPI_GPIO.18
RPI_GPIO_20: RPI_GPIO.20
RPI_GPIO_25: RPI_GPIO.25
RPI_GPIO_27: RPI_GPIO.27
RPI_GPIO_28: RPI_GPIO.28
RPI_GPIO_29: RPI_GPIO.29
RPI_GPIO_30: RPI_GPIO.30
RPI_GPIO_31: RPI_GPIO.31
RPI_GPIO_32: RPI_GPIO.32
RPI_GPIO_33: RPI_GPIO.33
RPI_GPIO_34: RPI_GPIO.34
RPI_GPIO_35: RPI_GPIO.35
RPI_GPIO_36: RPI_GPIO.36
RPI_GPIO_37: RPI_GPIO.37
RPI_GPIO_38: RPI_GPIO.38
RPI_GPIO_39: RPI_GPIO.39
RPI_GPIO_40: RPI_GPIO.40
SCLK: RPI_GPIO.23 ; also sheet 4
SOLENOID_1_NEGATIVE: U$6.A2 U$6.B2 ; also sheet 5
SOLENOID_2_NEGATIVE: U$7.A1 U$7.B1 ; also sheet 5
SOLENOID_3_NEGATIVE: U$7.A2 U$7.B2 ; also sheet 5

### Notes on the sheet
- External Signal Connectors | External Power Connectors
- RPI GPIO
- TODO: Figure out how to properly distinguish these on the hardware board?
- TC_4
- TC_3
- TC_2
- TC_1
- DO NOT CONNECT

## Sheet 9 of 10: Debug Pins Used for debugging outputs.
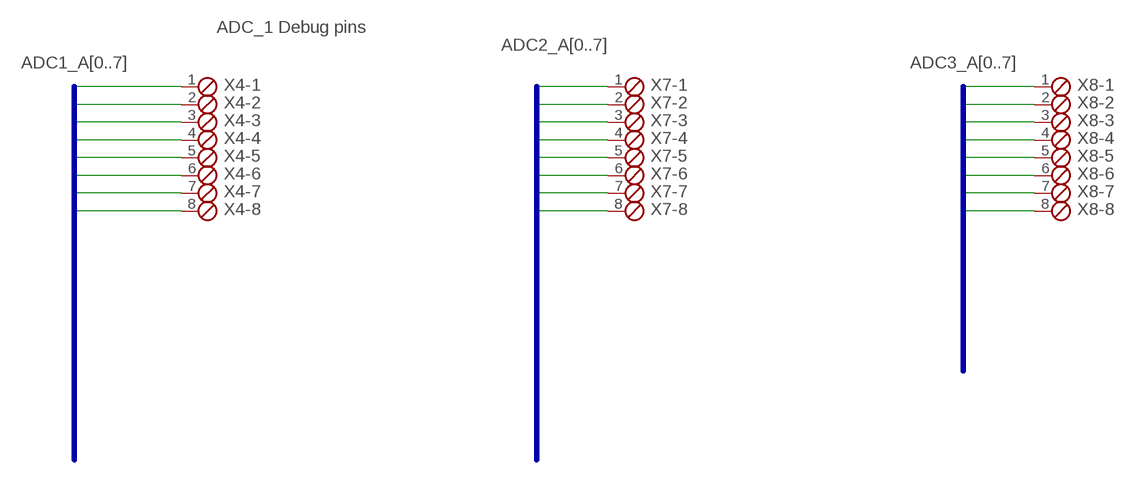
[diagram p8: schematic, sheet 9]

### Parts
X4  MPT8  [8POL254]
X7  MPT8  [8POL254]
X8  MPT8  [8POL254]

### Nets
ADC1_A0: X4.1 ; also sheet 2,4
ADC1_A1: X4.2 ; also sheet 2,4
ADC1_A2: X4.3 ; also sheet 2,4
ADC1_A3: X4.4 ; also sheet 2,4
ADC1_A4: X4.5 ; also sheet 2,4
ADC1_A5: X4.6 ; also sheet 2,4
ADC1_A6: X4.7 ; also sheet 2,4
ADC1_A7: X4.8 ; also sheet 2,4
ADC2_A0: X7.1 ; also sheet 4,7
ADC2_A1: X7.2 ; also sheet 4,7
ADC2_A2: X7.3 ; also sheet 4,7
ADC2_A3: X7.4 ; also sheet 4,7
ADC2_A4: X7.5 ; also sheet 4,8
ADC2_A5: X7.6 ; also sheet 4,8
ADC2_A6: X7.7 ; also sheet 4,8
ADC2_A7: X7.8 ; also sheet 4,8
ADC3_A0: X8.1 ; also sheet 4
ADC3_A1: X8.2 ; also sheet 4
ADC3_A2: X8.3 ; also sheet 4
ADC3_A3: X8.4 ; also sheet 4
ADC3_A4: X8.5 ; also sheet 4
ADC3_A5: X8.6 ; also sheet 4
ADC3_A6: X8.7 ; also sheet 4
ADC3_A7: X8.8 ; also sheet 4

### Buses
ADC1_A[0..7]
ADC2_A[0..7]
ADC3_A[0..7]

### Notes on the sheet
- ADC_1 Debug pins

## Sheet 10 of 10: Pin Assignments This sheet will be used to connect nets that are named such as ADC1_1 to LC1+ using junctions and shorts. For now it does not have a sheet border. I am unsure if it should have such a border.

## Library data of the parts
ADC1-ADC3 = microchip-extra:MCP3208: 2.7V Dual Channel 12-Bit A/D Converter with SPI Serial Interface Source: http://ww1.microchip.com/downloads/en/DeviceDoc/21034D.pdf; MF: MICROCHIP; MPN: MCP3202-CI/SN; OC_FARNELL: 1196803; OC_NEWARK: 19C7207
C1-C3 C8-C15 C18-C29 = rcl:C-US: CAPACITOR, American symbol
C4-C7 C16 C17 = rcl:CPOL-US: POLARIZED CAPACITOR, American symbol
D1-D4 = diode:1N4004: DIODE general purpose rectifier, 1 A
D5 = diode:DIODE-: DIODE
IC1-IC4 IC6-IC9 = st-microelectronics-extra:LMV321LICT: High Performance, 145 MHz FastFET Op Amps Source: http://www.analog.com/static/imported-files/data_sheets/AD8065_8066.pdf; MF: ALTERA CORPORATION; MPN: AD8065ARTZ-REEL7; OC_FARNELL: 1464845; OC_NEWARK: 59K6316
IC5 = texas-extra:UA78M*: POSITIVE-VOLTAGE REGULATORS Source: http://focus.ti.com/lit/ds/symlink/ua78m33.pdf
JP1-JP3 = pinhead:PINHD-1X2: PIN HEADER
LC_IN1 LC_IN2 = con-phoenix-250-extra:1770908: PHOENIX
LED1-LED4 = led:LED: LED OSRAM: - CHIPLED LG R971, LG N971, LY N971, LG Q971, LY Q971, LO R971, LY R971 LH N974, LH R974 LS Q976, LO Q976, LY Q976 LO Q996 - Hyper CHIPLED LW Q18S LB Q993, LB Q99A, LB R99A - SideLED LS A670, LO A670, LY A670, LG A670, LP A670 LB A673, LV A673, LT A673, LW A673 LH A674 LY A675 LS A676, LA A676, LO A676, LY A676, LW A676 LS A679, LY A679, LG A679 - Hyper Micro SIDELED® LS Y876, LA Y876, LO Y876, LY Y876 LT Y87S - SmartLED LW L88C, LW L88S LB L89C, LB L89S, LG L890 LS L89K, LO L89K, LY L89K LS L896, LA L896, LO L896, LY L896 - TOPLED LS T670, LO T670, LY T670, LG T670, LP T670 LSG T670, LSP T670, LSY T670, LOP T670, LYG T670 LG T671, LOG T671, LSG T671 LB T673, LV T673, LT T673, LW T673 LH T674 LS T676, LA T676, LO T676, LY T676, LB T676, LH T676, LSB T676, LW T676 LB T67C, LV T67C, LT T67C, LS T67K, LO T67K, LY T67K, LW E67C LS E67B, LA E67B, LO E67B, LY E67B, LB E67C, LV E67C, LT E67C LW T67C LS T679, LY T679, LG T679 LS T770, LO T770, LY T770, LG T770, LP T770 LB T773, LV T773, LT T773, LW T773 LH T774 LS E675, LA E675, LY E675, LS T675 LS T776, LA T776, LO T776, LY T776, LB T776 LHGB T686 LT T68C, LB T68C - Hyper Mini TOPLED® LB M676 - Mini TOPLED Santana® LG M470 LS M47K, LO M47K, LY M47K Source: http://www.osram.convergy.de LUXEON: - LUMILED® LXK2-PW12-R00, LXK2-PW12-S00, LXK2-PW14-U00, LXK2-PW14-V00 LXK2-PM12-R00, LXK2-PM12-S00, LXK2-PM14-U00 LXK2-PE12-Q00, LXK2-PE12-R00, LXK2-PE12-S00, LXK2-PE14-T00, LXK2-PE14-U00 LXK2-PB12-K00, LXK2-PB12-L00, LXK2-PB12-M00, LXK2-PB14-N00, LXK2-PB14-P00, LXK2-PB14-Q00 LXK2-PR12-L00, LXK2-PR12-M00, LXK2-PR14-Q00, LXK2-PR14-R00 LXK2-PD12-Q00, LXK2-PD12-R00, LXK2-PD12-S00 LXK2-PH12-R00, LXK2-PH12-S00 LXK2-PL12-P00, LXK2-PL12-Q00, LXK2-PL12-R00 Source: www.luxeon.com KINGBRIGHT: KA-3528ASYC Source: www.kingbright.com
PT_123_IN TC_PT4_IN = con-phoenix-250-extra:1770924: PHOENIX; OC_FARNELL: unknown; OC_NEWARK: unknown
R1-R9 R11 R12 R14-R17 R19-R21 R23-R25 R29-R34 R36-R59 = rcl:R-US_: RESISTOR, American symbol
R10 R13 R18 R22 = pot-extra:PTD902: 16mm Potentiometer two level Source: http://www.alphapotentiometers.net/html/16mm_pot_2.html
R26-R28 R35 = resistor:R-US_: RESISTOR, American symbol
REG1 = diodes-extra:AP2210N-3.3TRG1: 3.3V regulator 300mA rating.
RPI_GPIO = con-3m:2540-: 3M (TM) Pak 100 4-Wall Header Source: 3M; OC_FARNELL: 9838414; OC_NEWARK: unknown
U1 = texas-extra:LM1084ISX-5.0/NOPB; MANUFACTURER_PART_NUMBER: LM1084ISX5.0NOPB; VENDOR: Texas Instruments
U2-U5 = texas-extra:THS4531IDR; MANUFACTURER_PART_NUMBER: THS4531IDR; VENDOR: TEXAS INSTRUMENTS
U6 = SLIDE_SW:1101M2S3CQE2; COPYRIGHT: Copyright (C) 2015 Accelerated Designs. All rights reserved; MANUFACTURER_PART_NUMBER: 1101M2S3CQE2; VENDOR: C&K
U$1 U$4-U$7 = con-phoenix-500-extra:1991095
U$2 U$3 U$8 U$9 = transistor-fet-extra:2N7000
X4 X7 X8 = con-phoenix-254:MPT8: PHOENIX CONNECTOR; OC_FARNELL: unknown; OC_NEWARK: unknown

## Board
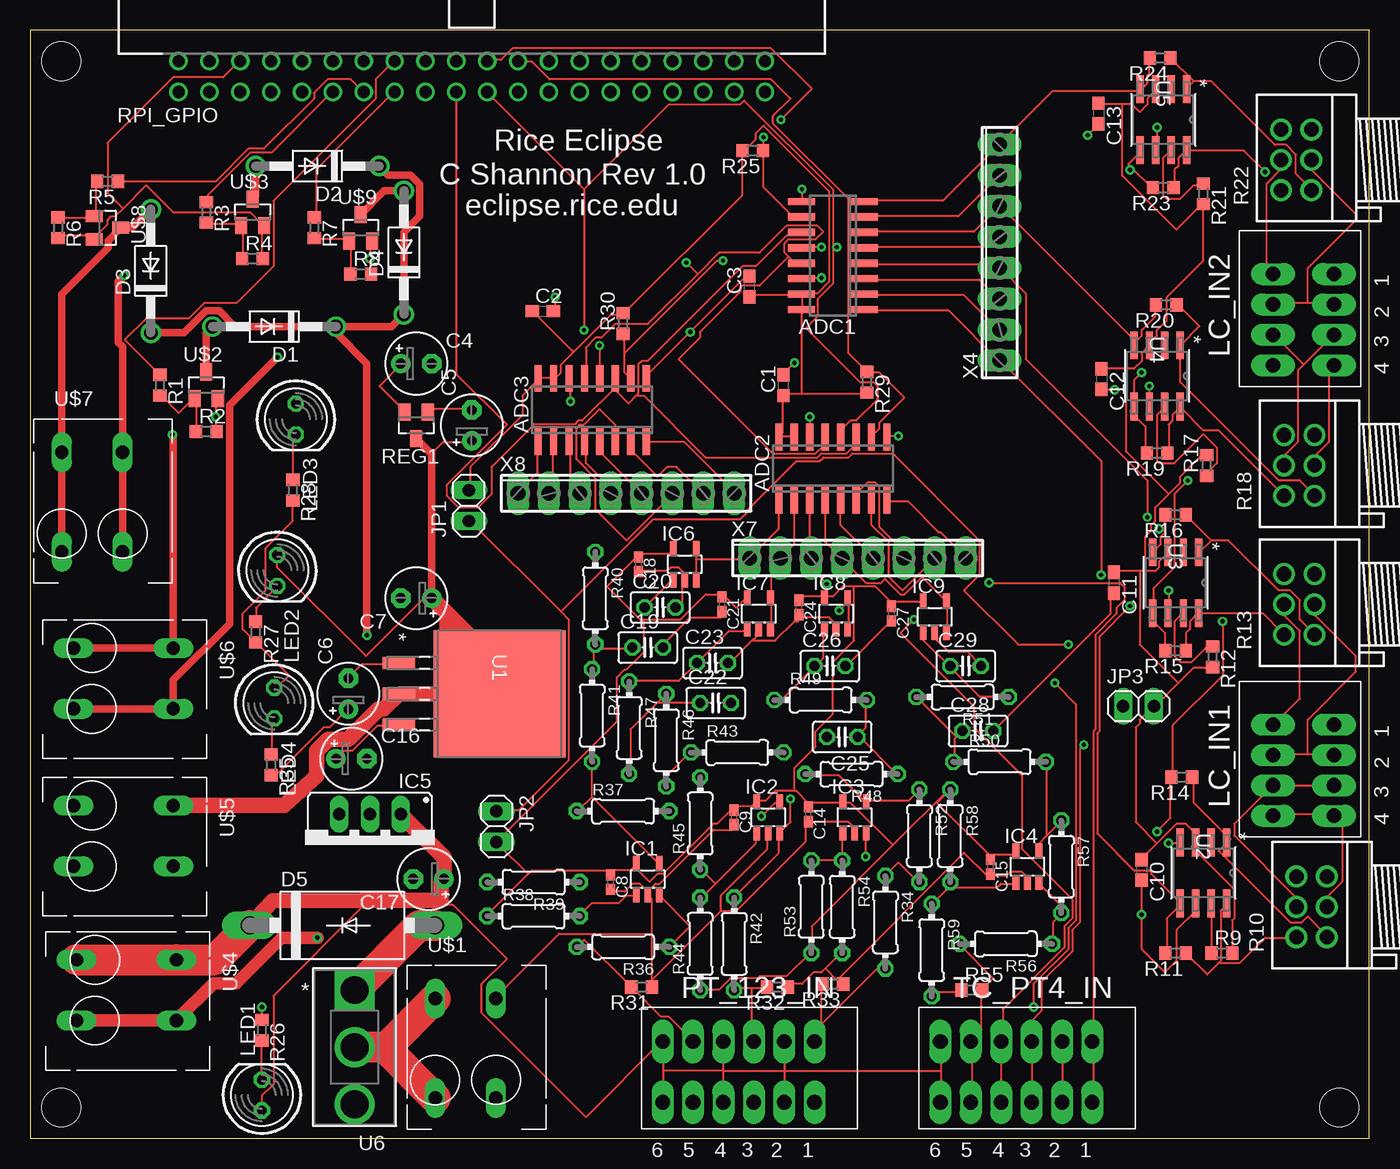
[diagram p9: board, top side]
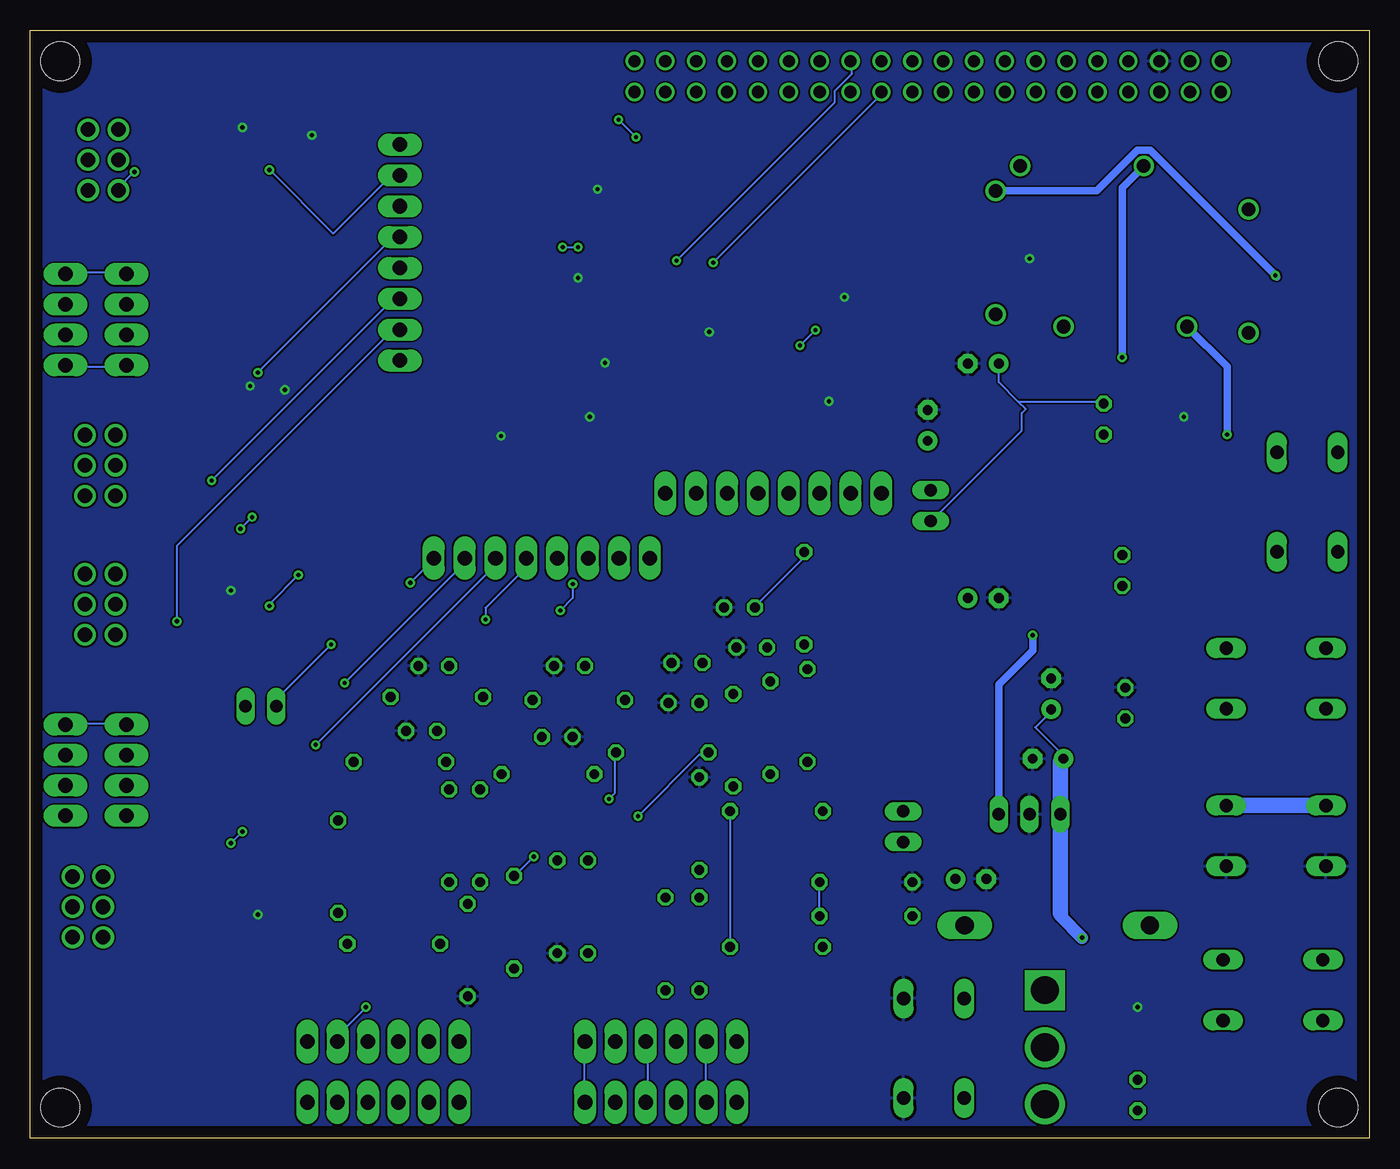
[diagram p10: board, bottom side, seen from below]

Size 110.16 x 91.18 mm. Coordinates in mm from the lower left corner, seen from the top.
Outline: 0,0 110.16,0 110.16,91.18 0,91.18 0,0
Copper layers (1*16): Top 0.035mm / dielectric 1.5mm / Bottom 0.035mm
Design rules "default": minimum track width 6mil, minimum drill 0.35mm, track to track 6mil, track to pad 6mil, pad to pad 6mil, via to via 6mil, smd to smd 6mil, copper to edge 40mil, drill to drill 6mil, minimum pad ring 10mil, minimum via ring 8mil, stop-mask expansion 4mil, vias tented up to drill 0mil, thermal gap 10mil
Holes 3.17 mm at 2.54,88.65 107.7,2.54 107.7,88.65 2.54,2.54

### Footprints (pad centres in the part's own frame; a part is rotated, then mirrored left to right if it is on the bottom)
SO-16 = smd 0.6 x 2.2: 1 -4.445,-2.6; 2 -3.175,-2.6; 3 -1.905,-2.6; 4 -0.635,-2.6; 5 0.635,-2.6; 6 1.905,-2.6; 7 3.175,-2.6; 8 4.445,-2.6; 9 4.445,2.6; 10 3.175,2.6; 11 1.905,2.6; 12 0.635,2.6; 13 -0.635,2.6; 14 -1.905,2.6; 15 -3.175,2.6; 16 -4.445,2.6
C0603 = smd 1.1 x 1: 1 -0.85,0; 2 0.85,0
E2,5-5 = drill 0.813 pad 1.6: + -1.27,0 | drill 0.813 pad 1.6 octagon: - 1.27,0
C0402K = smd 0.925 x 0.74: 1 -0.6,0; 2 0.6,0
C025-025X050 = drill 0.813 octagon: 1 -1.27,0; 2 1.27,0
DO41-10 = drill 1.118: A 5.08,0; C -5.08,0
DO201-15 = drill 1.499 long: A 7.62,0; C -7.62,0
SOT23-5 = smd 0.55 x 1.2: 1 -0.95,-1.3; 2 0,-1.3; 3 0.95,-1.3; 4 0.95,1.3; 5 -0.95,1.3
TO220S = drill 1.016 long: 1 -2.54,-2.54; 2 0,-2.54; 3 2.54,-2.54
1X02 = drill 1.016 long: 1 -1.27,0; 2 1.27,0
1770908 = drill 1.2 long: P$1 3.55,2.7; P$2 6.05,2.7; P$3 8.55,2.7; P$4 11.05,2.7; P$5 3.55,7.7; P$6 6.05,7.7; P$7 8.55,7.7; P$8 11.05,7.7
LED5MM = drill 0.813 octagon: A -1.27,0; K 1.27,0
1770924 = drill 1.2 long: P$1 3.55,2.7; P$2 6.05,2.7; P$3 8.55,2.7; P$4 11.05,2.7; P$5 13.55,2.7; P$6 16.05,2.7; P$7 3.55,7.7; P$8 6.05,7.7; P$9 8.55,7.7; P$10 11.05,7.7; P$11 13.55,7.7; P$12 16.05,7.7
R0603 = smd 1 x 1.1: 1 -0.85,0; 2 0.85,0
PTD902 = drill 1.2: 1-1 -2.5,0; 1-2 0,0; 1-3 2.5,0; 2-1 -2.5,2.5; 2-2 0,2.5; 2-3 2.5,2.5
0204/7 = drill 0.813 octagon: 1 -3.81,0; 2 3.81,0
SOT23 = smd 1 x 1.4: 1 -0.95,-1.1; 2 0.95,-1.1; 3 0,1.1
PAK100/2500-5-40 = drill 1 pad 1.422: 1 -24.13,-1.27; 2 -24.13,1.27; 3 -21.59,-1.27; 4 -21.59,1.27; 5 -19.05,-1.27; 6 -19.05,1.27; 7 -16.51,-1.27; 8 -16.51,1.27; 9 -13.97,-1.27; 10 -13.97,1.27; 11 -11.43,-1.27; 12 -11.43,1.27; 13 -8.89,-1.27; 14 -8.89,1.27; 15 -6.35,-1.27; 16 -6.35,1.27; 17 -3.81,-1.27; 18 -3.81,1.27; 19 -1.27,-1.27; 20 -1.27,1.27; 21 1.27,-1.27; 22 1.27,1.27; 23 3.81,-1.27; 24 3.81,1.27; 25 6.35,-1.27; 26 6.35,1.27; 27 8.89,-1.27; 28 8.89,1.27; 29 11.43,-1.27; 30 11.43,1.27; 31 13.97,-1.27; 32 13.97,1.27; 33 16.51,-1.27; 34 16.51,1.27; 35 19.05,-1.27; 36 19.05,1.27; 37 21.59,-1.27; 38 21.59,1.27; 39 24.13,-1.27; 40 24.13,1.27
TS3B = smd 1.016 x 2.692: 1 -2.54,-8.28; 2 0,-8.28; 3 2.54,-8.28 | smd 10.465 x 10.871: 4 0,0
D8-M = smd 2.286 x 0.61: 1 -2.515,1.905; 2 -2.515,0.635; 3 -2.515,-0.635; 4 -2.515,-1.905; 5 2.515,-1.905; 6 2.515,-0.635; 7 2.515,0.635; 8 2.515,1.905
1101M2S3CQE2 = drill 2.286 pad 2.794 square: 1 0,9.398 | drill 2.286 pad 2.794: 2 0,4.699; 3 0,0
1991095 = drill 1.1 long: A1 -2.5,8.2; A2 2.5,8.2; B1 -2.5,0; B2 2.5,0
8POL254 = drill 1.2 long: 1 -8.89,0; 2 -6.35,0; 3 -3.81,0; 4 -1.27,0; 5 1.27,0; 6 3.81,0; 7 6.35,0; 8 8.89,0

### Placement (x,y rotation side)
ADC1  66.04,72.64 90 top
ADC2  66.04,55.12 0 top
ADC3  46.23,59.94 0 top
C1  61.98,61.98 90 top
C2  42.16,68.07 0 top
C3  59.18,70.1 90 top
C4  31.75,63.75 0 top
C5  36.32,58.67 90 top
C6  26.16,36.58 90 top
C7  31.75,44.45 180 top
C8  47.75,21.08 270 top
C9  57.91,26.42 270 top
C10  91.44,22.1 270 top
C11  89.15,45.72 270 top
C12  88.14,62.48 270 top
C13  87.88,84.33 270 top
C14  64.01,26.67 270 top
C15  78.99,22.35 270 top
C16  26.42,31.24 0 top
C17  32.77,21.34 180 top
C18  50.04,47.24 270 top
C19  50.8,40.39 0 top
C20  51.82,43.69 0 top
C21  56.9,43.94 270 top
C22  56.39,35.81 0 top
C23  56.13,39.12 0 top
C24  63.25,43.69 270 top
C25  66.8,33.02 180 top
C26  65.79,38.86 0 top
C27  70.87,43.18 270 top
C28  77.98,33.53 0 top
C29  76.96,38.86 0 top
D1  20.07,66.8 180 top
D2  23.62,80.01 180 top
D3  9.91,71.37 90 top
D4  30.73,72.9 90 top
D5  25.65,17.53 0 top
IC1  50.8,21.34 0 top
IC2  60.71,26.42 0 top
IC3  67.82,26.42 0 top
IC4  82.04,22.35 0 top
IC5  27.94,24.13 180 top
IC6  53.85,47.24 0 top
IC7  59.94,43.18 0 top
IC8  66.29,43.18 0 top
IC9  74.42,42.93 0 top
JP1  36.07,52.07 90 top
JP2  38.35,25.65 270 top
JP3  91.19,35.56 0 top
LC_IN1  99.57,37.59 270 top
LC_IN2  99.57,74.68 270 top
LED1  19.05,3.56 90 top
LED2  20.32,46.74 270 top
LED3  21.84,59.18 270 top
LED4  20.07,35.81 270 top
PT_123_IN  68.07,10.67 180 top
R1  10.67,61.98 270 top
R2  14.48,58.17 0 top
R3  14.48,76.2 270 top
R4  18.29,72.39 0 top
R5  6.35,78.74 180 top
R6  2.29,74.93 270 top
R7  23.37,74.93 270 top
R8  27.18,71.12 0 top
R9  98.04,15.24 0 top
R10  106.68,19.05 90 top
R11  94.23,15.24 180 top
R12  97.28,39.62 270 top
R13  105.66,43.94 90 top
R14  94.74,29.72 180 top
R15  94.23,40.13 180 top
R16  94.23,51.31 180 top
R17  96.77,55.37 90 top
R18  105.66,55.37 90 top
R19  92.71,56.39 180 top
R20  93.47,68.58 180 top
R21  96.52,77.72 270 top
R22  105.41,80.52 90 top
R23  93.22,78.23 180 top
R24  92.96,88.9 180 top
R25  59.44,81.28 180 top
R26  19.05,8.89 270 top
R27  18.54,41.66 270 top
R28  21.59,53.34 270 top
R29  68.83,62.23 270 top
R30  48.77,67.06 90 top
R31  50.29,12.45 180 top
R32  61.47,12.45 180 top
R33  66.04,12.7 180 top
R34  70.36,17.78 270 top
R35  19.81,30.73 270 top
R36  48.77,15.75 180 top
R37  48.77,26.92 0 top
R38  41.4,18.29 0 top
R39  41.4,21.08 180 top
R40  46.48,44.45 270 top
R41  46.23,34.8 270 top
R42  57.91,16 270 top
R43  58.17,31.75 0 top
R44  55.12,16 90 top
R45  55.12,25.91 90 top
R46  52.32,32.77 270 top
R47  49.28,33.78 270 top
R48  67.56,29.97 180 top
R49  65.02,36.07 0 top
R50  79.76,30.99 0 top
R51  76.71,36.32 180 top
R52  73.15,24.89 270 top
R53  64.26,19.05 90 top
R54  66.8,19.05 270 top
R55  77.47,12.19 0 top
R56  80.26,16 180 top
R57  84.84,22.35 270 top
R58  75.69,24.89 270 top
R59  74.17,15.49 270 top
REG1  31.75,58.67 180 top
RPI_GPIO  36.32,87.38 0 top
TC_PT4_IN  90.93,10.67 180 top
U1  38.61,36.58 270 top
U2  96.52,21.84 270 top
U3  94.23,45.72 270 top
U4  92.71,62.74 270 top
U5  93.22,83.82 270 top
U6  26.67,2.79 0 top
U$1  35.81,3.3 0 top
U$2  14.48,61.98 0 top
U$3  18.29,76.2 0 top
U$4  3.81,12.19 270 top
U$5  3.56,24.89 270 top
U$6  3.56,37.85 270 top
U$7  5.08,48.26 0 top
U$8  6.35,74.93 270 top
U$9  27.18,74.93 0 top
X4  79.76,72.9 90 top
X7  68.07,47.75 0 top
X8  49.02,53.09 0 top

### Tracks (layer width: path | path; a pad name or v marks a point on that pad's centre or on a via)
+3V3  (via drill 0.35)
  Top 0.152: REG1.2 30.8,59.85 28.73,61.91 30.48,63.66 C4.+ | 21.91,60.48 LED3.A | 43.66,43.34 36.2,50.8 JP1.1 | 43.66,43.34 44.29,42.7 44.29,31.11 40.16,26.99 38.42,26.99 JP2.1 | v85.41,40.64 81.28,40.64 76.83,45.09 78.11,46.35 78.11,49.21 70.96,56.36 67.63,56.36 67.31,56.04 65.25,56.04 64.93,55.72 63.02,55.72 59.05,51.75 59.05,51.59 58.42,50.96 51.28,50.96 43.66,43.34
  Bottom 0.152: v85.41,40.64 89.85,36.2 89.85,35.56 JP3.1 | C4.+ 30.48,62.23 28.89,60.64 | 28.89,60.64 28.26,60.01 28.57,59.69 28.57,58.26 36.04,50.8 JP1.1 | 28.89,60.64 21.91,60.64 LED3.A
+3V3_ADC
  Top 0.152: C3.1 59.21,69.37 63.34,69.37 ADC1.15 | ADC1.15 63.5,69.37 63.5,68.26 ADC1.16 63.5,68.1 63.5,61.28 | 61.59,57.78 61.91,58.1 61.91,61.12 C1.1 62.07,61.28 63.5,61.28 | 63.5,61.28 68.74,61.28 R29.2 | 61.59,57.78 62.87,57.78 ADC2.15 | 61.59,57.78 ADC2.16 | 44.77,64.77 43.66,63.66 43.66,63.02 43.18,62.55 ADC3.15 43.02,62.55 41.91,62.55 ADC3.16 41.75,62.39 40.48,61.12 40.48,59.53 36.2,55.24 36.2,53.34 JP1.2 | 44.77,64.77 47.78,67.79 48.74,67.79 R30.2 48.9,67.94 58.58,77.63 R25.2 58.74,81.28 59.69,82.23 59.69,82.71 60.33,83.34 65.72,77.95 65.72,70.48 64.77,69.53 63.5,69.53 ADC1.15 | 44.77,64.77 44.61,64.77 41.43,67.94 C2.1
+3V3_LC
  Top 0.152: 89.85,85.09 90.65,85.09 91.28,84.45 91.92,85.09 91.92,85.57 92.55,86.2 U5.3 | 89.85,85.09 87.95,85.09 C13.1 | 90.17,63.34 90.81,63.34 91.44,63.98 91.44,64.61 U4.3 92.08,65.41 92.71,66.04 92.71,66.52 93.5,67.31 93.5,69.22 96.52,72.23 R21.2 96.52,76.99 94.3,74.77 89.85,79.22 89.85,85.09 | 90.17,63.34 88.27,63.34 C12.1 | 92.71,24.29 94.3,25.88 95.09,25.88 96.2,24.77 95.89,24.45 U2.3 95.89,24.29 95.57,23.97 99.06,20.48 99.06,18.1 98.9,17.94 R9.2 | 92.71,24.29 91.44,23.02 C10.1 | 94.46,37.47 92.55,35.56 JP3.2 92.39,35.56 91.28,34.45 91.28,34.13 90.96,33.81 90.96,26.04 92.71,24.29 | 94.46,37.47 95.73,38.73 97.16,38.73 R12.2 | 91.76,46.67 92.55,46.67 92.87,46.99 92.87,47.47 93.5,48.1 U3.3 | 91.76,46.67 91.28,46.67 | 91.28,46.67 89.22,46.67 C11.1 | 93.66,53.02 92.55,51.91 92.55,50.8 92.23,50.48 92.23,50.01 91.76,49.53 91.76,46.67 | 93.66,53.02 94.61,53.98 94.61,54.45 96.36,56.2 96.68,56.2 R17.2 | 94.46,37.47 91.28,40.64 91.28,46.67 | 90.17,63.34 90.17,56.52 93.66,53.02
+3V3_PT
  Top 0.152: IC7.5 58.9,44.45 58.1,43.66 56.99,44.77 C21.1 56.83,44.77 55.56,44.77 53.5,42.7 50.48,42.7 | IC6.5 52.86,48.42 52.55,48.1 50.16,48.1 C18.1 50.01,47.94 47.47,45.4 50.16,42.7 50.48,42.7 | 49.69,22.38 49.85,22.54 IC1.5 49.69,22.38 | 49.69,22.38 49.37,22.07 47.78,22.07 C8.1 47.62,22.07 41.27,22.07 40.96,21.75 | 40.96,21.75 37.62,18.41 R38.1 | 40.96,21.75 38.42,24.29 JP2.2 48.26,34.29 48.26,37.94 48.9,38.58 49.05,38.58 50.48,40.01 50.48,42.7 | R44.1 55.24,12.22 56.67,12.22 57.63,13.18 59.85,13.18 60.01,13.34 62.23,13.34 64.14,15.24 R53.1 64.29,15.24 64.29,17.46 70.96,24.13 | C24.1 63.34,44.61 65.25,44.61 IC8.5 65.41,44.61 66.04,44.61 66.83,45.4 67.79,45.4 | IC9.5 73.34,44.13 70.96,44.13 C27.1 70.8,44.13 69.53,45.4 67.79,45.4 | 62.87,28.57 63.02,28.57 63.98,27.62 C14.1 64.14,27.62 66.83,27.62 IC3.5 66.99,27.62 67.47,27.62 70.96,24.13 | 62.87,28.57 61.28,28.57 60.48,27.78 59.85,27.78 IC2.5 59.69,27.62 59.37,27.3 57.94,27.3 C9.1 57.78,27.15 56.52,25.88 56.2,25.88 52.07,21.75 51.59,21.75 50.96,21.11 49.69,22.38 | IC4.5 80.96,23.5 80.8,23.34 79.06,23.34 C15.1 78.9,23.34 74.61,27.62 R58.1 75.56,28.73 70.96,24.13 | 67.79,45.4 67.79,40.96 66.04,39.21 66.04,34.92 64.61,33.5 64.61,32.23 62.87,30.48 62.87,28.57
+5V
  Top 0.152: C5.+ 36.2,57.31 33.97,57.31 33.18,56.52 33.02,56.3 | LED2.A 20.32,47.94 20.32,46.99 27.62,39.69 32.7,44.77 C7.+
  Top 0.61: REG1.3 33.02,56.3 C7.+
  Top 1.27: U$5.A1 20.89,27.39 23.56,29.81 23.56,31.9 24.49,32.83 26.15,32.83 28.66,35.33 29.08,35.33 U1.2 U1.4 38.61,38.86 C7.+ 34.29,43.18 34.29,41.4
  Bottom 1.27: U$5.B1 U$5.A1
+10V  (via drill 0.35)
  Top 0.152: U1.3 30.32,33.97 28.57,33.97 26.51,31.91 25.88,31.91 25.24,31.27 C16.+ | R35.2 19.84,30 20.32,30 24.13,33.81 24.61,33.81 26.04,35.24 C6.+
  Top 1.016: U$4.B2 U$4.A2 15.08,12.76 16.92,12.76 20.66,16.51 v23.62,16.51
  Bottom 0.152: C16.+ 25.4,31.75 27.46,33.81 26.04,35.24 C6.+
  Bottom 1.016: v23.62,16.51 25.4,18.29 25.4,18.51
  Bottom 1.27: 25.4,18.51 IC5.3 25.4,30.99 C16.+
+12V  (via drill 0.35)
  Top 0.152: LED1.A 19.05,3.49 20,4.45 20,11.75 27.3,19.05 27.3,19.57 | 74.93,5.56 74.93,7.94 TC_PT4_IN.P$6 | 74.93,5.56 74.93,3.02 TC_PT4_IN.P$12 | 62.07,5.56 62.07,7.94 PT_123_IN.P$2 | 62.07,5.56 62.07,3.02 PT_123_IN.P$8 | 52.07,5.56 52.07,7.94 PT_123_IN.P$6 51.91,7.94 45.72,1.75 37.15,10.32 37.15,12.7 39.21,14.76 34.77,19.21 34.29,19.21 33.81,19.58 | 52.07,5.56 52.07,3.02 PT_123_IN.P$12 | 56.99,5.56 56.99,7.94 PT_123_IN.P$4 | 56.99,5.56 56.99,3.02 PT_123_IN.P$10 | 56.99,5.56 52.07,5.56 | 56.99,5.56 62.07,5.56 | 62.07,5.56 74.93,5.56
  Top 0.508: D1.C 25.15,66.29
  Top 0.61: D3.C 12.65,66.29 14.45,68.1 15.52,68.1 16.82,66.8 D1.C 29.72,66.8 D4.C 30.73,74.59 32.03,75.89 32.03,78.52 31.27,79.27 29.44,79.27 D2.C | 25.15,66.29 27.69,63.75 v27.69,41.4
  Top 1.27: 30.48,26.42 IC5.1 34.04,23.11 C17.+ 33.81,21.11 33.81,19.58 31.15,19.58 27.3,19.57 19.95,19.56 D5.C
  Top 2.54: U$4.B1 U$4.A1 15.2,14.69 D5.C
  Bottom 0.61: IC5.1 30.48,37.34 27.69,40.13 v27.69,41.4
+12V_DEBUG
  Top 2.54: 29.3,7.49 U$1.A1 | 29.3,7.49 U6.2 | U$1.B1 29.3,7.31 29.3,7.49
ADC1_A0  (via drill 0.35)
  Top 0.152: R11.2 93.5,15.24 93.5,18.1 94.61,19.21 U2.5 94.61,19.37 92.23,21.75 92.23,21.91 92.08,22.07 90.81,22.07 87.79,25.08 87.79,33.34 87.95,33.5 87.95,41.27 v90.49,43.81 | ADC1.1 68.74,68.1 75.56,68.1 79.69,63.98 X4.1 79.85,63.98 88.11,55.72 v88.11,46.35
  Bottom 0.152: v90.49,43.81 90.49,43.97 v88.11,46.35
ADC1_A1  (via drill 0.35)
  Top 0.152: v92.71,25.24 93.82,26.35 93.82,29.69 R14.2 93.98,29.84 93.98,33.97 98.11,38.1 v98.11,42.55 | v93.66,24.29 94.61,24.29 U2.4 | ADC1.2 68.74,69.37 76.83,69.37 79.69,66.52 X4.2
  Bottom 0.152: v93.66,24.29 v92.71,25.24 | v98.11,42.55 98.11,48.74 80.96,65.88 80.49,65.88 79.85,66.52 X4.2
ADC1_A2  (via drill 0.35)
  Top 0.152: R15.2 93.34,40.16 93.34,41.59 92.08,42.86 92.39,43.18 U3.5 92.39,43.34 92.39,45.24 94.14,46.99 94.14,53.02 v95.25,54.13 | ADC1.3 68.74,70.64 78.11,70.64 79.69,69.06 X4.3
  Bottom 0.152: v95.25,54.13 80.96,68.42 80.49,68.42 79.85,69.06 X4.3
ADC1_A3  (via drill 0.35)
  Top 0.152: 93.34,50.16 93.34,49.85 93.03,49.53 93.03,48.9 92.39,48.26 U3.4 | 93.34,50.16 93.34,51.28 R16.2 | ADC1.4 68.74,71.91 79.53,71.91 79.69,71.75 X4.4 79.85,71.6 81.92,69.53 81.92,64.14 91.92,54.13 v91.92,51.12 | v92.87,50.16 93.34,50.16
  Bottom 0.152: v91.92,51.12 v92.87,50.16
ADC1_A4  (via drill 0.35)
  Top 0.152: R19.2 91.76,56.52 91.76,58.58 90.49,59.85 90.81,60.17 U4.5 90.81,62.39 v91.44,63.02 | ADC1.5 68.74,73.34 78.9,73.34 79.69,74.14 X4.5
  Bottom 0.152: v91.44,63.02 80.96,73.5 80.49,73.5 79.85,74.14 X4.5
ADC1_A5
  Top 0.152: 90.96,65.56 90.81,65.41 U4.4 90.96,65.56 | 90.96,65.56 91.44,66.04 91.44,66.52 92.55,67.63 92.55,68.58 R20.2 | ADC1.6 68.74,74.61 77.63,74.61 79.69,76.68 X4.6 79.85,76.68 90.96,65.56
ADC1_A6  (via drill 0.35)
  Top 0.152: 90.65,79.85 90.33,80.17 91.44,81.28 U5.5 | 90.65,79.85 92.23,78.26 R23.2 | ADC1.7 68.74,75.88 76.36,75.88 79.69,79.22 X4.7 | v90.49,79.69 90.65,79.85
  Bottom 0.152: v90.49,79.69 85.25,74.45 81.12,78.58 80.49,78.58 79.85,79.22 X4.7
ADC1_A7
  Top 0.152: R24.2 92.08,88.9 92.08,87.63 91.92,87.47 91.92,86.84 91.44,86.36 U5.4 91.28,86.2 84.14,86.2 79.85,81.92 X4.8 79.69,81.76 75.09,77.15 68.74,77.15 ADC1.8
ADC1_CS  (via drill 0.35)
  Top 0.152: 60.33,81.28 60.33,78.26 63.02,75.56 63.34,75.88 ADC1.10 | v61.75,83.82 64.29,86.36 60.96,89.69 39.69,89.69 38.73,88.74 37.62,88.74 RPI_GPIO.22 | 60.33,81.28 v60.33,82.39 | 60.33,81.28 R25.1
  Bottom 0.152: v60.33,82.39 v61.75,83.82
ADC2_A0
  Top 0.152: 54.77,47.62 54.77,48.42 IC6.4 | 54.77,47.62 54.77,46.04 IC6.3 | 54.77,47.62 59.05,47.62 X7.1 61.59,50.16 ADC2.1
ADC2_A1
  Top 0.152: IC7.3 60.96,41.91 60.96,44.45 IC7.4 60.96,44.61 60.96,46.99 X7.2 62.87,48.9 ADC2.2
ADC2_A2  (via drill 0.35)
  Top 0.152: 67.31,44.2 67.31,44.45 IC8.4 | 67.31,44.2 67.31,41.91 IC8.3 | ADC2.3 64.14,47.78 X7.3 64.26,46.88 v65.53,45.61 | v66.55,43.43 67.31,44.2
  Bottom 0.152: v65.53,45.61 65.53,44.45 v66.55,43.43
ADC2_A3
  Top 0.152: IC9.3 75.41,41.75 75.41,44.13 IC9.4 75.25,44.29 73.34,46.2 71.91,44.77 71.6,44.77 70.33,46.04 70.01,45.72 68.74,45.72 66.83,47.62 X7.4 66.67,47.78 65.41,49.05 ADC2.4
ADC2_A4  (via drill 0.35)
  Top 0.152: TC_PT4_IN.P$10 79.85,3.02 79.85,7.94 TC_PT4_IN.P$4 80.01,8.1 80.01,10.64 85.09,15.72 85.09,17.46 85.72,18.1 85.72,19.68 81.6,23.81 81.6,29.84 77.63,33.81 77.63,35.56 71.6,41.59 v72.71,42.7 | ADC2.5 66.67,50.48 69.37,47.78 X7.5
  Bottom 0.152: v72.71,42.7 72.71,43.66 70.01,46.35 70.01,46.99 69.37,47.62 X7.5
ADC2_A5  (via drill 0.35)
  Top 0.152: TC_PT4_IN.P$9 82.39,3.02 82.39,7.94 TC_PT4_IN.P$3 82.39,8.1 82.39,9.68 83.19,10.48 83.19,12.86 85.72,15.4 85.72,17.14 86.36,17.78 86.36,32.07 v86.68,32.38 | ADC2.6 67.94,53.02 68.9,53.98 69.53,53.98 69.85,53.66 69.85,50.32 72.07,48.1 71.75,47.78 X7.6
  Bottom 0.152: v86.68,32.38 72.55,46.51 72.55,46.99 71.91,47.62 X7.6
ADC2_A6  (via drill 0.35)
  Top 0.152: TC_PT4_IN.P$8 84.93,3.02 84.93,7.94 TC_PT4_IN.P$2 | ADC2.7 69.22,50.48 70.64,49.05 70.64,46.2 71.75,45.09 X7.7 | v82.55,10.79 82.55,12.7 85.41,15.56 85.41,17.3 86.04,17.94 86.04,35.72 v84.3,37.47
  Bottom 0.152: v82.55,10.79 84.77,8.57 84.77,8.1 TC_PT4_IN.P$2 | v84.3,37.47 75.09,46.67 75.09,46.99 74.45,47.62 X7.7
ADC2_A7  (via drill 0.35)
  Top 0.152: TC_PT4_IN.P$7 87.47,3.02 87.47,7.94 TC_PT4_IN.P$1 87.47,8.1 87.47,33.5 87.63,33.66 87.63,41.43 89.38,43.18 89.38,43.66 90.01,44.29 90.01,45.4 89.69,45.72 v78.9,45.72 | ADC2.8 70.48,52.39 72.23,52.39 74.77,49.85 74.93,49.85 76.99,47.78 X7.8
  Bottom 0.152: v78.9,45.72 76.99,47.62 X7.8
ADC2_CS
  Top 0.152: ADC2.10 69.22,57.78 69.85,58.42 69.85,58.9 71.91,60.96 69.85,63.02 68.9,63.02 R29.1 68.74,63.18 67.31,64.61 67.31,77.31 61.12,83.5 61.12,84.14 62.55,85.57 60.96,87.15 42.7,87.15 41.27,88.58 40.16,88.58 RPI_GPIO.24
ADC3_A0
  Top 0.152: ADC3.1 41.75,57.31 41.75,54.77 40.16,53.18 X8.1
ADC3_A1
  Top 0.152: ADC3.2 43.02,57.31 43.02,53.5 42.7,53.18 X8.2
ADC3_A2
  Top 0.152: ADC3.3 44.45,57.31 44.45,53.82 45.09,53.18 X8.3
ADC3_A3
  Top 0.152: ADC3.4 45.72,57.31 45.72,55.56 47.94,53.34 47.78,53.18 X8.4
ADC3_A4
  Top 0.152: ADC3.5 46.99,57.31 46.99,56.36 50.16,53.18 X8.5
ADC3_A5
  Top 0.152: ADC3.6 48.1,57.47 48.1,58.74 46.83,60.01 45.56,58.74 45.24,58.74 44.93,58.42 44.93,55.88 46.51,54.29 46.51,51.75 49.05,49.21 52.86,53.02 X8.6
ADC3_A6
  Top 0.152: ADC3.7 49.53,57.31 49.53,56.52 51.59,54.45 52.39,55.24 53.18,55.24 55.24,53.18 X8.7
ADC3_A7
  Top 0.152: ADC3.8 50.8,57.31 53.82,57.31 57.94,53.18 X8.8
ADC3_CS  (via drill 0.35)
  Top 0.152: 48.9,64.61 48.9,63.02 49.37,62.55 ADC3.10 | 48.9,64.61 48.9,66.2 R30.1 | v56.99,72.23 56.52,72.23 48.9,64.61
  Bottom 0.152: v56.99,72.23 43.97,85.25 43.97,86.2 42.55,87.63 42.55,88.58 RPI_GPIO.26
CTRL_SOLENOID_1
  Top 0.152: R3.1 14.61,77.15 14.61,77.63 18.1,81.12 19.84,81.12 24.77,86.04 RPI_GPIO.11
CTRL_SOLENOID_2
  Top 0.152: R5.1 15.24,78.74 17.94,81.44 19.21,81.44 23.34,85.57 23.34,86.04 24.45,87.15 26.35,87.15 27.3,86.2 RPI_GPIO.13
CTRL_SOLENOID_3
  Top 0.152: R7.1 23.5,75.88 23.5,79.69 29.84,86.04 RPI_GPIO.15
GND  (via drill 0.35)
  Top 0.152: IC3.2 67.94,25.4 67.31,26.04 64.14,26.04 C14.2 63.82,25.72 63.82,24.45 58.1,18.73 56.83,18.73 | 51.12,16.83 51.12,19.68 50.8,20 IC1.2 50.8,20.32 | 51.12,16.83 51.12,13.02 | 51.12,13.02 51.12,12.7 R31.1 | 50.8,20.32 50.16,20.95 49.53,20.95 48.9,20.32 47.94,20.32 C8.2 | 50.8,20.32 51.44,20.95 51.75,20.95 56.2,25.4 57.78,25.4 C9.2 | 56.83,18.73 56.83,20 60.64,23.81 60.64,25.08 IC2.2 | 51.12,13.02 56.83,18.73 | R4.2 19.05,72.39 19.05,74.93 U$3.2 19.05,75.25 18.1,76.2 11.75,76.2 9.53,78.42 7.62,76.52 | R6.2 2.54,74.3 5.08,74.3 U$8.2 5.4,74.3 6.35,75.25 6.35,75.56 6.67,75.88 6.99,75.88 7.62,76.52 | C3.2 59.05,70.8 58.74,70.8 v54.29,66.36 50.48,62.55 ADC3.9 | C10.2 v91.44,18.41 91.44,15.56 93.34,13.65 94.3,14.61 94.3,17.14 95.89,18.73 U2.6 | C18.2 50.16,46.67 52.39,46.67 52.7,46.99 53.34,46.99 53.98,46.35 53.66,46.04 IC6.2 53.66,45.72 53.66,44.13 53.34,43.81 C20.2 | IC8.2 66.04,41.91 66.36,42.23 65.72,42.86 63.5,42.86 C24.2 63.18,42.55 62.87,42.55 61.28,40.96 59.37,40.96 | IC4.2 82.23,21.27 81.6,21.91 80.64,21.91 80.33,21.59 79.06,21.59 C15.2 78.74,21.59 76.83,23.5 66.36,13.02 | R8.2 27.94,71.12 v27.94,72.39 27.94,73.66 U$9.2 | R2.2 15.24,58.42 v15.24,59.37 15.24,60.64 U$2.2 | v19.05,10.79 R26.1 | 65.41,13.97 66.67,15.24 R54.2 | 65.41,13.97 65.09,13.65 64.45,13.65 63.5,12.7 62.55,12.7 R32.1 | LED4.A 20.32,37.15 21.27,38.1 18.73,40.64 R27.2 18.41,40.96 17.46,41.91 17.46,43.18 19.37,45.09 19.37,48.58 21.59,50.8 R28.2 | 65.41,13.97 66.36,13.02 | 66.36,13.02 66.67,12.7 R33.1 | R55.1 76.52,12.06 74.61,12.06 74.3,11.75 R59.2 | v43.18,69.22 43.18,68.26 C2.2 | C27.2 70.8,42.23 70.48,42.23 67.31,39.05 C26.2
  Top 0.152: C21.2 56.83,42.86 54.29,42.86 52.07,40.64 C19.2 | v62.87,63.82 62.23,63.18 62.23,62.87 C1.2 | C28.2 88.9,43.18 88.9,44.77 C11.2 | v89.22,61.59 88.27,61.59 C12.2 | v87,82.55 87.63,83.19 C13.2 | IC9.2 74.61,41.59 74.61,40.96 75.56,40.01 77.15,40.01 78.11,39.05 C29.2 | 59.37,40.96 57.47,39.05 C23.2 | 59.37,40.96 59.69,41.27 59.69,41.59 IC7.2 | REG1.1 32.7,60.01 36.2,60.01 C5.- | v44.45,60.64 44.45,62.23 ADC3.14 | v64.14,59.37 ADC2.14 | v71.44,57.78 70.48,57.78 ADC2.9 | v65.09,70.8 63.5,70.8 ADC1.14 | v63.5,78.11 63.5,77.15 ADC1.9 | v93.66,45.09 93.66,43.5 U3.6 | v92.08,61.91 U4.6 | v92.71,83.19 92.71,81.6 U5.6 | U1.1 30.16,39.05 27.3,39.05 26.35,38.1 C6.- | 7.62,76.52 6.35,77.79 6.35,81.92 11.75,87.31 15.88,87.31 17.14,88.58 RPI_GPIO.6 | 51.12,16.83 43.5,16.83 38.42,11.75 U$1.A2
  pour Bottom: 0,91.19 110.24,91.19 110.24,-0.25 0,-0.25
IGNITION_RELAY
  Top 0.152: R1.1 10.64,62.87 7.78,65.72 9.53,67.47 13.02,67.47 14.29,68.74 16.99,68.74 20,71.75 20,77.15 28.42,85.57 28.42,87.15 29.84,88.58 RPI_GPIO.16
LC_1_OUT+
  Top 0.152: R10.2-2 104.14,19.05 104.14,19.84 99.06,24.92 99.06,25.88 102.23,29.05 LC_IN1.P$3 102.39,29.05 107.16,29.05 LC_IN1.P$7
LC_1_OUT-
  Top 0.152: R10.1-2 106.68,19.84 107.95,21.11 107.95,25.88 107.31,26.51 LC_IN1.P$8 107.16,26.67 102.39,26.67 LC_IN1.P$4
LC_2_OUT+
  Top 0.152: R13.2-2 103.19,43.81 103.19,43.02 104.46,41.75 104.46,36.2 102.39,34.13 LC_IN1.P$1
  Bottom 0.152: LC_IN1.P$1 102.39,34.13 107.16,34.13 LC_IN1.P$5
LC_2_OUT-
  Top 0.152: 105.09,31.59 107.16,31.59 LC_IN1.P$6 | 105.09,31.59 102.39,31.59 LC_IN1.P$2 | 105.09,31.59 105.09,34.45 109.06,38.42 109.06,39.69 105.73,43.02 105.73,43.81 R13.1-2
LC_3_OUT+
  Top 0.152: 104.78,63.66 107.16,66.04 LC_IN2.P$7 | 104.78,63.66 104.3,63.18 104.3,57.31 103.19,56.2 103.19,55.4 R18.2-2 | 104.78,63.66 102.39,66.04 LC_IN2.P$3
LC_3_OUT-
  Top 0.152: R18.1-2 105.73,55.4 105.73,56.2 106.84,57.31 106.84,63.18 107.16,63.5 LC_IN2.P$8
  Bottom 0.152: LC_IN2.P$4 102.39,63.5 107.16,63.5 LC_IN2.P$8
LC_4_OUT+
  Top 0.152: R22.2-2 102.87,80.49 102.87,79.69 101.76,78.58 101.76,71.75 102.23,71.28 LC_IN2.P$1
  Bottom 0.152: LC_IN2.P$1 102.39,71.28 107.16,71.28 LC_IN2.P$5
LC_4_OUT-
  Top 0.152: 105.09,68.74 107.16,68.74 LC_IN2.P$6 | 105.09,68.74 102.39,68.74 LC_IN2.P$2 | R22.1-2 105.41,79.69 109.06,76.04 109.06,75.56 105.09,71.6 105.09,68.74
MISO  (via drill 0.35)
  Top 0.152: v46.83,65.25 46.83,62.55 ADC3.12 | 45.56,78.11 v45.56,66.52 | 45.56,78.11 37.62,86.04 RPI_GPIO.21 | ADC2.12 66.67,58.26 67.47,59.05 67.94,59.05 69.69,60.8 69.69,61.91 69.37,62.23 68.26,62.23 63.82,66.67 64.77,67.63 64.77,69.06 66.04,70.33 66.04,73.34 | 66.04,73.34 66.04,78.11 58.74,85.41 58.42,85.09 52.55,85.09 45.56,78.11 | v65.09,73.34 63.5,73.34 ADC1.12 | 66.04,73.34 v66.36,73.34
  Bottom 0.152: v45.56,66.52 v46.83,65.25 | v66.36,73.34 v65.09,73.34
MOSI
  Top 0.152: 48.26,61.91 48.26,61.44 49.21,60.48 49.85,61.12 | 48.26,61.91 48.26,62.39 ADC3.11 48.26,61.91 | 49.85,61.12 50.01,61.28 50.01,63.66 50.32,63.98 50.8,63.98 58.58,71.75 59.69,71.75 62.23,74.3 63.18,74.3 63.34,74.45 ADC1.11 | ADC2.11 67.94,57.15 67.15,56.36 65.09,56.36 64.77,56.04 55.56,56.04 50.48,61.12 49.85,61.12 | 48.26,61.91 45.4,59.05 45.09,59.05 44.77,58.74 41.43,58.74 37.94,55.24 37.94,53.02 36.83,51.91 35.24,51.91 34.29,52.86 34.29,53.82 39.21,58.74 35.08,62.87 35.08,86.04 RPI_GPIO.19
N$1
  Top 0.152: LED1.K R26.2
N$2
  Top 0.152: R27.1 18.57,42.55 18.57,43.66 20.32,45.4 LED2.K
N$3
  Top 0.152: R28.1 21.59,57.63 21.75,57.78 LED3.K
N$4
  Top 2.54: U6.1 32,17.53 D5.A
N$5
  Top 0.152: R2.1 13.65,58.26 13.65,60.8 U$2.1 13.49,60.96 12.22,59.69 10.79,61.12 R1.2
N$6
  Top 0.152: R4.1 17.46,72.39 17.46,75.09 U$3.1 17.3,75.25 14.61,75.25 R3.2
N$7
  Top 0.152: R6.1 2.38,75.72 5.24,75.72 U$8.1 5.4,75.88 5.4,78.74 R5.2
N$8
  Top 0.152: R8.1 26.35,71.12 26.35,73.82 U$9.1 26.19,73.98 23.5,73.98 R7.2
N$9
  Top 0.152: R35.1 19.84,31.59 19.84,34.29 20,34.45 LED4.K
N$10
  Top 0.152: R36.1 54.29,17.46 51.75,20 IC1.3
  Bottom 0.152: R37.2 52.55,26.83 52.55,15.88 R36.1
N$11
  Top 0.152: 46.35,40.32 46.35,40.64 R40.2 46.35,40.32 | 46.35,40.32 46.35,38.73 R41.1 | 46.35,40.32 49.53,40.32 C19.1
N$12
  Top 0.152: IC1.1 49.85,20 49.05,20 48.42,19.37 46.2,19.37 45.24,18.41 R38.2
  Bottom 0.152: R39.1 45.24,20.95 45.24,18.41 R38.2
N$13
  Top 0.152: U2.7 97.16,15.24 R9.1
N$14
  Top 0.152: 97.79,14.45 97.95,14.61 97.95,18.73 98.42,19.21 U2.8 | 97.79,14.45 96.84,13.49 R11.1 | 97.79,14.45 99.54,14.45 101.6,16.51 104.14,16.51 R10.2-1
N$15
  Top 0.152: R12.1 97.16,40.32 96.68,40.32 95.57,39.21 94.61,39.21 94.14,39.69 94.14,42.55 94.77,43.18 U3.7
N$16
  Top 0.152: R15.1 95.09,40.16 95.09,41.59 95.41,41.91 95.41,42.55 96.04,43.18 U3.8 96.2,43.18 101.44,43.18 103.03,41.59 R13.2-1
N$17
  Top 0.152: 98.42,24.29 98.74,24.61 95.73,27.62 95.73,29.69 R14.1 | 98.42,24.29 97.79,23.65 103.66,17.78 104.62,17.78 105.09,18.26 106.68,16.67 R10.1-1 | 98.42,24.29 U2.1
N$18
  Top 0.152: 97.16,49.21 95.09,51.28 R16.1 | 97.16,49.21 96.2,48.26 U3.1 | 97.16,49.21 98.58,49.21 102.71,45.09 103.66,45.09 104.46,44.29 104.46,42.7 105.57,41.59 R13.1-1
N$19
  Top 0.152: R17.1 96.84,54.61 96.84,54.77 97.63,55.56 97.63,56.83 96.52,57.94 94.14,55.56 92.87,55.56 92.71,55.72 92.71,59.53 93.34,60.17 U4.7
N$20
  Top 0.152: 94.61,60.17 93.98,59.53 93.98,59.05 93.66,58.74 93.66,56.52 R19.1 | 94.61,60.17 96.52,58.26 97.79,58.26 103.03,53.02 R18.2-1 | 94.61,60.17 U4.8
N$21
  Top 0.152: U4.1 96.2,66.83 94.46,68.58 R20.1 | U4.1 94.61,62.23 102.71,54.13 104.46,54.13 105.57,53.02 R18.1-1 | U4.1
N$22
  Top 0.152: R21.1 96.52,78.42 95.73,78.42 94.61,77.31 93.5,77.31 93.19,77.63 93.19,80.64 93.82,81.28 U5.7
N$23  (via drill 0.35)
  Top 0.152: R23.1 94.14,78.26 94.14,79.69 94.46,80.01 94.46,80.64 95.09,81.28 U5.8 95.25,81.28 99.85,81.28 v101.6,79.53
  Bottom 0.152: v101.6,79.53 103.03,78.11 R22.2-1
N$24
  Top 0.152: 95.73,87 R24.1 | 95.73,87 95.09,86.36 U5.1 | 95.73,87 97.16,87 102.39,81.76 103.35,81.76 104.14,80.96 104.14,79.38 105.41,78.11 R22.1-1
N$25
  Top 0.152: IC6.1 52.86,45.88 52.7,45.88 50.64,43.81 C20.1
  Bottom 0.152: R40.1 46.51,48.26 46.51,47.78 50.48,43.81 C20.1
N$26  (via drill 0.35)
  Top 0.152: R42.1 61.59,23.5 61.59,25.08 IC2.3 61.75,25.24 62.55,26.04 v62.55,27.94
  Bottom 0.152: v62.55,27.94 62.07,28.42 62.07,31.75 R43.2
N$27
  Top 0.152: 56.36,20.95 55.24,19.84 R44.2 | 56.36,20.95 59.69,24.29 59.69,25.08 IC2.1 | 56.36,20.95 55.24,22.07 R45.1
N$28
  Top 0.152: 51.59,35.88 52.23,36.51 R46.1 | 51.59,35.88 49.37,33.66 49.37,30 R47.2 | 51.59,35.88 55.09,35.88 C22.1
N$29
  Top 0.152: IC7.1 58.9,41.75 57.47,41.75 54.93,39.21 C23.1 54.77,39.05 53.34,37.62 49.37,37.62 R47.1
N$30
  Top 0.152: 68.1,33.18 71.28,30 R48.1 | 68.1,33.18 67.94,33.02 C25.1 68.1,33.18 | 68.1,33.18 68.74,33.81 68.74,36.04 R49.2
N$31
  Top 0.152: IC8.1 65.25,41.75 65.25,39.53 64.61,38.89 C26.1 64.45,38.73 61.91,36.2 61.28,36.2 R49.1
N$32
  Top 0.152: C28.1 76.2,33.02 | 76.2,33.02 76.04,32.86 76.04,31.11 R50.1 | 76.2,33.02 R51.2
N$33
  Top 0.152: IC9.1 73.5,41.59 73.5,40.96 75.56,38.89 C29.1 75.72,38.73 78.11,36.35 80.49,36.35 R51.1
N$34  (via drill 0.35)
  Top 0.152: v68.74,23.18 68.74,25.08 IC3.3 | R52.2 73.03,21.11 71.44,22.7 70.33,21.59 R34.1
  Bottom 0.152: v68.74,23.18 70.33,21.59 R34.1
N$35
  Top 0.152: IC3.1 66.83,25.08 66.83,22.86 R54.1 R53.2
N$36
  Top 0.152: IC4.3 83.03,20.95 85.09,18.89 84.77,18.57 R57.2 84.77,18.41 84.14,17.78 84.14,16.03 R56.1
N$37
  Top 0.152: 75.72,20.64 75.56,20.64 74.3,19.37 R59.1 | 75.72,20.64 79.53,20.64 79.85,20.95 80.96,20.95 IC4.1 | 75.72,20.64 75.72,20.95 R58.2
PT1_PREC
  Top 0.152: 46.2,28.1 51.59,22.7 IC1.4 | 46.2,28.1 45.09,26.99 R37.1 | 46.2,28.1 46.2,30.96 R41.2
PT1_VS-
  Top 0.152: R36.2 45.56,16.35 49.37,12.54 R31.2 49.53,12.38 51.91,10 52.55,10 54.45,8.1 PT_123_IN.P$5
  Bottom 0.152: PT_123_IN.P$11 54.61,3.02 54.61,7.94 PT_123_IN.P$5
PT2_PREC  (via drill 0.35)
  Top 0.152: v60.17,26.51 61.28,27.62 61.59,27.62 IC2.4 | R46.2 52.39,29.05 52.39,29.84 54.29,31.75 R43.1
  Bottom 0.152: v60.17,26.51 55.09,31.59 54.61,31.59 54.45,31.75 R43.1
PT2_VS-
  Top 0.152: 59.37,12.38 58.1,12.38 R42.2 | 59.37,12.38 60.48,12.38 R32.2 | 59.37,12.38 59.37,8.1 PT_123_IN.P$3
  Bottom 0.152: PT_123_IN.P$9 59.37,3.02 59.37,7.94 PT_123_IN.P$3
PT3_PREC
  Top 0.152: R52.1 72.23,27.78 68.9,27.78 IC3.4 68.74,27.62 66.52,29.84 63.82,29.84 R48.2
PT3_VS-
  Top 0.152: 65.09,9.37 65.09,8.57 64.61,8.1 PT_123_IN.P$1 65.09,9.37 | 65.09,9.37 65.09,12.7 R33.2 | R34.2 69.69,13.97 65.09,9.37
  Bottom 0.152: PT_123_IN.P$7 64.61,3.02 64.61,7.94 PT_123_IN.P$1
PT4_PREC
  Top 0.152: 83.66,24.92 84.77,26.04 R57.1 | 83.66,24.92 83.03,24.29 83.03,23.65 IC4.4 | 83.66,24.92 83.66,30.96 R50.2
PT4_VS-
  Top 0.152: R56.2 76.52,15.88 79.22,13.18 78.26,12.22 R55.2 78.26,12.06 78.26,8.89 77.47,8.1 TC_PT4_IN.P$5 77.47,7.94 77.47,3.02 TC_PT4_IN.P$11
RELAY_NEGATIVE  (via drill 0.35)
  Top 0.61: U$2.3 14.48,66.29 D1.A | U$6.B1 U$6.A1 11.76,57.84 v11.68,57.91
  Bottom 0.61: v11.68,57.91 11.68,63.5 D1.A
SCLK  (via drill 0.35)
  Top 0.152: 54.93,71.12 56.67,72.87 60.01,72.87 62.23,75.09 64.77,75.09 65.25,74.61 64.61,73.98 62.39,73.98 62.07,73.66 62.07,72.87 62.39,72.55 | 54.93,71.12 50.8,66.99 48.1,66.99 46.99,65.88 46.51,65.88 45.72,65.09 45.72,62.55 ADC3.13 | 62.39,72.55 63.18,71.75 63.34,71.91 ADC1.13 | ADC2.13 65.41,57.15 64.61,56.36 61.12,56.36 53.34,64.14 55.09,65.88 55.09,66.36 58.42,69.69 58.42,70.01 58.58,70.17 60.01,70.17 62.39,72.55 | 54.93,71.12 v53.98,72.07
  Bottom 0.152: v53.98,72.07 40.16,85.88 40.16,86.04 RPI_GPIO.23
SOLENOID_1_NEGATIVE  (via drill 0.35)
  Top 0.61: U$3.3 18.54,77.55 D2.A | U$6.B2 U$6.A2 11.76,37.71 16.39,42.34 16.39,60.33 v20.32,64.26
  Bottom 0.61: v20.32,64.26 20.32,78.23 D2.A
SOLENOID_2_NEGATIVE
  Top 0.61: D3.A 8.38,74.93 U$8.3 6.41,73.89 6.41,73.29 2.58,69.46 U$7.A1 U$7.B1
SOLENOID_3_NEGATIVE  (via drill 0.35)
  Top 0.61: D4.A 29.13,77.98 U$9.3 | v7.72,71.02 7.25,70.55 7.25,65.5 7.58,65.17 U$7.A2 U$7.B2
  Bottom 0.61: D4.A 22.41,77.98 19.08,81.31 18,81.31 v7.72,71.02 7.58,70.88

### Text on the board
tPlace: Rice Eclipse | C Shannon Rev 1.0 | eclipse.rice.edu